# Altium project BA-77GHz-Radar_Frontend.PrjPcb (part 1 of 2)
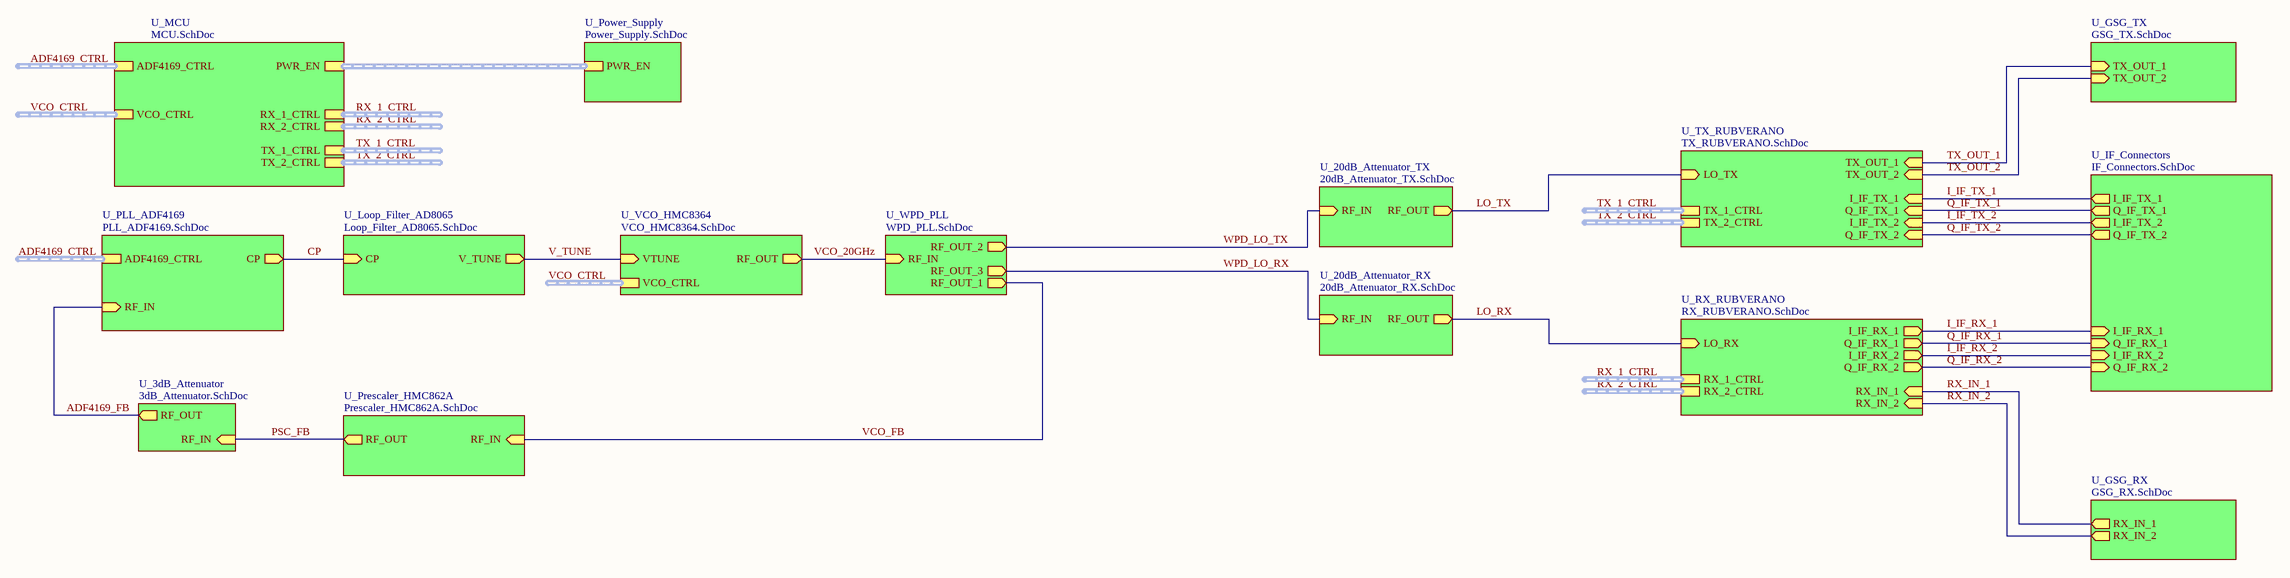
[diagram p0: Top_Level.SchDoc]
25 sheets, 275 parts. Net scope: hierarchical (ports join the sheet entries above them; power ports are global).
Board file: BA-77GHz-Radar_Frontend.PcbDoc
Sheets:
  Top_Level.SchDoc
    U_Power_Supply = Power_Supply.SchDoc
      Boost_Converter_16V = TPS61377_16V.SchDoc
      LDO_OPV_15V = LT3042_15V.SchDoc
      LDO_VCO_5V = LT3042_5V.SchDoc
      LDO_Prescaler_5V = LT3042_5V.SchDoc
      LDO_Analog_ADF4169_3V3 = LT3042_3V3.SchDoc
      LDO_TX_3V3 = LT3045_3V3.SchDoc
      LDO_Digital_ADF4169_1V8 = XC6204_1V8.SchDoc
      Buck_Converter_4V = AP62500_4V.SchDoc
      Buck_Converter_6V = AP62500_6V.SchDoc
      LDO_STM32_3V3 = TLV755P_3V3.SchDoc
      LDO_RX_3V3 = LT3045_3V3.SchDoc
    U_MCU = MCU.SchDoc
    U_PLL_ADF4169 = PLL_ADF4169.SchDoc
    U_Prescaler_HMC862A = Prescaler_HMC862A.SchDoc
    U_Loop_Filter_AD8065 = Loop_Filter_AD8065.SchDoc
    U_VCO_HMC8364 = VCO_HMC8364.SchDoc
    U_TX_RUBVERANO = TX_RUBVERANO.SchDoc
    U_RX_RUBVERANO = RX_RUBVERANO.SchDoc
    U_3dB_Attenuator = 3dB_Attenuator.SchDoc
    U_WPD_PLL = WPD_PLL.SchDoc
    U_20dB_Attenuator_RX = 20dB_Attenuator_RX.SchDoc
    U_20dB_Attenuator_TX = 20dB_Attenuator_TX.SchDoc
    U_GSG_RX = GSG_RX.SchDoc
    U_GSG_TX = GSG_TX.SchDoc
    U_IF_Connectors = IF_Connectors.SchDoc

## Sheet Top_Level.SchDoc
size A2; SheetNumber: 1; SheetTotal: 25

### Sub-sheets
U_3dB_Attenuator = 3dB_Attenuator.SchDoc: RF_IN (in), RF_OUT (out)
U_20dB_Attenuator_RX = 20dB_Attenuator_RX.SchDoc: RF_IN (in), RF_OUT (out)
U_20dB_Attenuator_TX = 20dB_Attenuator_TX.SchDoc: RF_IN (in), RF_OUT (out)
U_GSG_RX = GSG_RX.SchDoc: RX_IN_1 (out), RX_IN_2 (out)
U_GSG_TX = GSG_TX.SchDoc: TX_OUT_1 (in), TX_OUT_2 (in)
U_IF_Connectors = IF_Connectors.SchDoc: Q_IF_TX_2 (out), I_IF_TX_2 (out), Q_IF_RX_2 (in), I_IF_RX_2 (in), I_IF_RX_1 (in), Q_IF_RX_1 (in), I_IF_TX_1 (out), Q_IF_TX_1 (out)
U_Loop_Filter_AD8065 = Loop_Filter_AD8065.SchDoc: V_TUNE (out), CP (in)
U_MCU = MCU.SchDoc: PWR_EN (harness PWR_EN), ADF4169_CTRL (harness ADF4169_CTRL), VCO_CTRL (harness VCO_CTRL), RX_1_CTRL (harness RX_1_CTRL), RX_2_CTRL (harness RX_2_CTRL), TX_1_CTRL (harness TX_1_CTRL), TX_2_CTRL (harness TX_2_CTRL)
U_PLL_ADF4169 = PLL_ADF4169.SchDoc: ADF4169_CTRL (harness ADF4169_CTRL), CP (out), RF_IN (in)
U_Power_Supply = Power_Supply.SchDoc: PWR_EN (harness PWR_EN)
U_Prescaler_HMC862A = Prescaler_HMC862A.SchDoc: RF_IN (in), RF_OUT (out)
U_RX_RUBVERANO = RX_RUBVERANO.SchDoc: I_IF_RX_1 (out), I_IF_RX_2 (out), Q_IF_RX_1 (out), Q_IF_RX_2 (out), RX_IN_1 (in), RX_IN_2 (in), RX_2_CTRL (harness RX_2_CTRL), RX_1_CTRL (harness RX_1_CTRL), LO_RX (in)
U_TX_RUBVERANO = TX_RUBVERANO.SchDoc: I_IF_TX_1 (in), I_IF_TX_2 (in), Q_IF_TX_2 (in), Q_IF_TX_1 (in), TX_OUT_1 (in), TX_OUT_2 (in), TX_2_CTRL (harness TX_2_CTRL), TX_1_CTRL (harness TX_1_CTRL), LO_TX (in)
U_VCO_HMC8364 = VCO_HMC8364.SchDoc: VTUNE (in), VCO_CTRL (harness VCO_CTRL), RF_OUT (out)
U_WPD_PLL = WPD_PLL.SchDoc: RF_IN (in), RF_OUT_1 (out), RF_OUT_2 (out), RF_OUT_3 (out)

### Nets
ADF4169_FB: sheet U_PLL_ADF4169/RF_IN, sheet U_3dB_Attenuator/RF_OUT
CP: sheet U_PLL_ADF4169/CP, sheet U_Loop_Filter_AD8065/CP
I_IF_RX_1: sheet U_RX_RUBVERANO/I_IF_RX_1, sheet U_IF_Connectors/I_IF_RX_1
I_IF_RX_2: sheet U_RX_RUBVERANO/I_IF_RX_2, sheet U_IF_Connectors/I_IF_RX_2
I_IF_TX_1: sheet U_TX_RUBVERANO/I_IF_TX_1, sheet U_IF_Connectors/I_IF_TX_1
I_IF_TX_2: sheet U_TX_RUBVERANO/I_IF_TX_2, sheet U_IF_Connectors/I_IF_TX_2
LO_RX: sheet U_RX_RUBVERANO/LO_RX, sheet U_20dB_Attenuator_RX/RF_OUT
LO_TX: sheet U_TX_RUBVERANO/LO_TX, sheet U_20dB_Attenuator_TX/RF_OUT
PSC_FB: sheet U_Prescaler_HMC862A/RF_OUT, sheet U_3dB_Attenuator/RF_IN
Q_IF_RX_1: sheet U_RX_RUBVERANO/Q_IF_RX_1, sheet U_IF_Connectors/Q_IF_RX_1
Q_IF_RX_2: sheet U_RX_RUBVERANO/Q_IF_RX_2, sheet U_IF_Connectors/Q_IF_RX_2
Q_IF_TX_1: sheet U_TX_RUBVERANO/Q_IF_TX_1, sheet U_IF_Connectors/Q_IF_TX_1
Q_IF_TX_2: sheet U_TX_RUBVERANO/Q_IF_TX_2, sheet U_IF_Connectors/Q_IF_TX_2
RX_IN_1: sheet U_RX_RUBVERANO/RX_IN_1, sheet U_GSG_RX/RX_IN_1
RX_IN_2: sheet U_RX_RUBVERANO/RX_IN_2, sheet U_GSG_RX/RX_IN_2
TX_OUT_1: sheet U_TX_RUBVERANO/TX_OUT_1, sheet U_GSG_TX/TX_OUT_1
TX_OUT_2: sheet U_TX_RUBVERANO/TX_OUT_2, sheet U_GSG_TX/TX_OUT_2
V_TUNE: sheet U_Loop_Filter_AD8065/V_TUNE, sheet U_VCO_HMC8364/VTUNE
VCO_20GHz: sheet U_VCO_HMC8364/RF_OUT, sheet U_WPD_PLL/RF_IN
VCO_FB: sheet U_Prescaler_HMC862A/RF_IN, sheet U_WPD_PLL/RF_OUT_1
WPD_LO_RX: sheet U_WPD_PLL/RF_OUT_3, sheet U_20dB_Attenuator_RX/RF_IN
WPD_LO_TX: sheet U_WPD_PLL/RF_OUT_2, sheet U_20dB_Attenuator_TX/RF_IN

### Buses and harness runs
harness ADF4169_CTRL = sheet U_MCU/ADF4169_CTRL
harness ADF4169_CTRL = sheet U_PLL_ADF4169/ADF4169_CTRL
harness RX_1_CTRL = sheet U_MCU/RX_1_CTRL
harness RX_1_CTRL = sheet U_RX_RUBVERANO/RX_1_CTRL
harness RX_2_CTRL = sheet U_MCU/RX_2_CTRL
harness RX_2_CTRL = sheet U_RX_RUBVERANO/RX_2_CTRL
harness sheet U_MCU/PWR_EN = sheet U_Power_Supply/PWR_EN
harness TX_1_CTRL = sheet U_MCU/TX_1_CTRL
harness TX_1_CTRL = sheet U_TX_RUBVERANO/TX_1_CTRL
harness TX_2_CTRL = sheet U_MCU/TX_2_CTRL
harness TX_2_CTRL = sheet U_TX_RUBVERANO/TX_2_CTRL
harness VCO_CTRL = sheet U_MCU/VCO_CTRL
harness VCO_CTRL = sheet U_VCO_HMC8364/VCO_CTRL

## Sheet Power_Supply.SchDoc
size A3; SheetNumber: 2; SheetTotal: 25
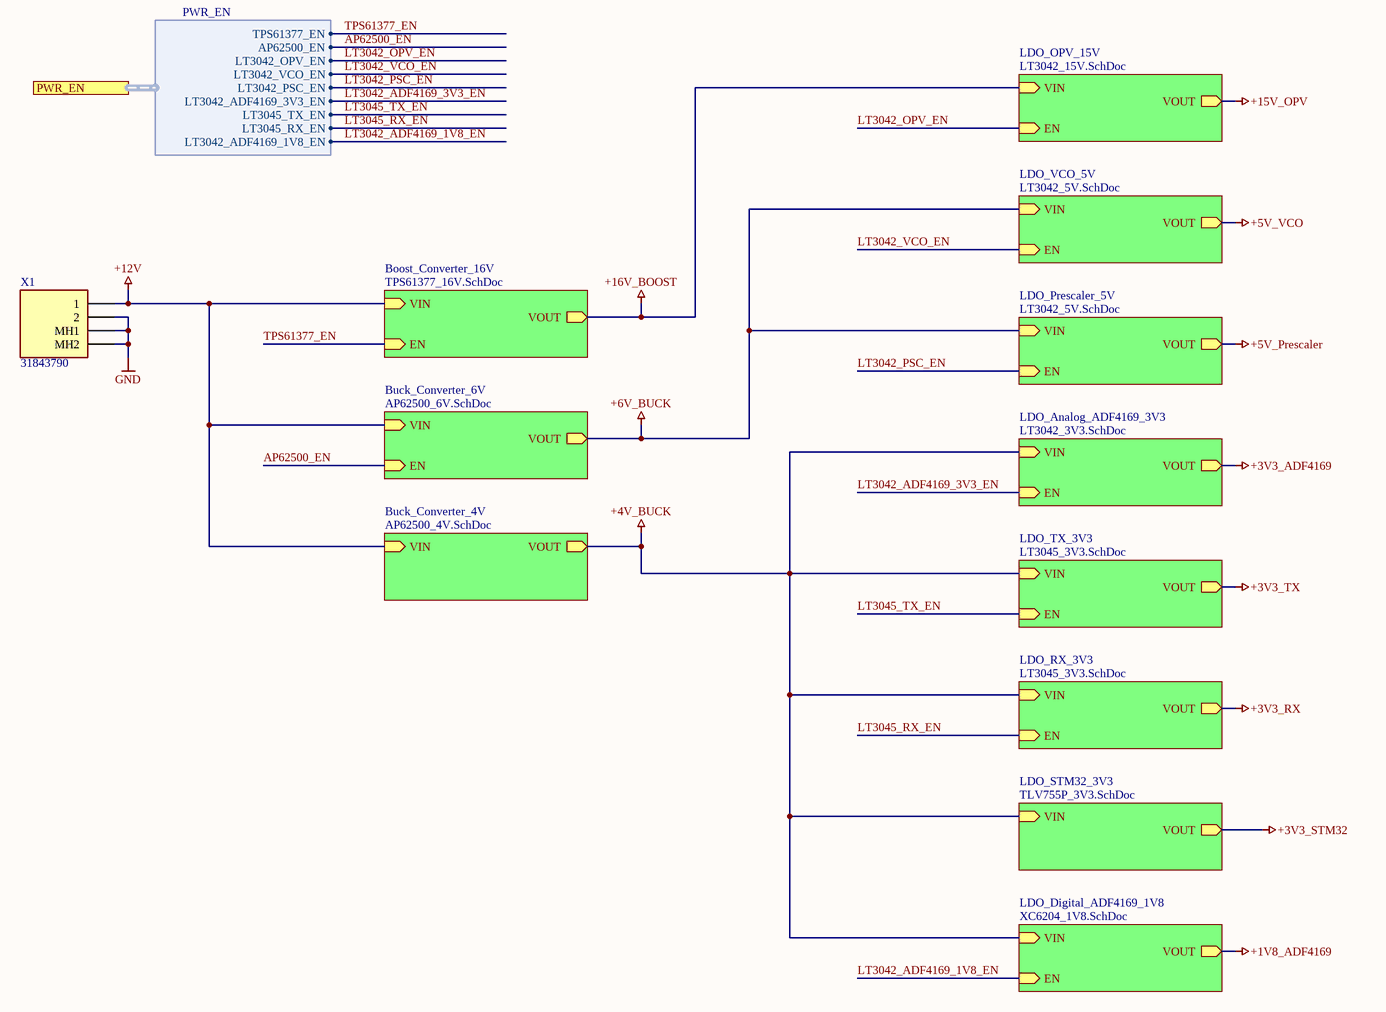
[diagram p1: Power_Supply.SchDoc]

### Parts
X1  31843790  [31843790]

### Sub-sheets
Boost_Converter_16V = TPS61377_16V.SchDoc: VIN (in), VOUT (out), EN (in)
Buck_Converter_4V = AP62500_4V.SchDoc: VIN (in), VOUT (out)
Buck_Converter_6V = AP62500_6V.SchDoc: VIN (in), VOUT (out), EN (in)
LDO_Analog_ADF4169_3V3 = LT3042_3V3.SchDoc: VIN (in), EN (in), VOUT (out)
LDO_Digital_ADF4169_1V8 = XC6204_1V8.SchDoc: VOUT (out), EN (in), VIN (in)
LDO_OPV_15V = LT3042_15V.SchDoc: VOUT (out), VIN (in), EN (in)
LDO_Prescaler_5V = LT3042_5V.SchDoc: VIN (in), EN (in), VOUT (out)
LDO_RX_3V3 = LT3045_3V3.SchDoc: VIN (in), EN (in), VOUT (out)
LDO_STM32_3V3 = TLV755P_3V3.SchDoc: VOUT (out), VIN (in)
LDO_TX_3V3 = LT3045_3V3.SchDoc: VOUT (out), EN (in), VIN (in)
LDO_VCO_5V = LT3042_5V.SchDoc: VIN (in), EN (in), VOUT (out)

### Ports
PWR_EN (harness PWR_EN, see Top_Level[3B], MCU[5B])

### Harnesses
PWR_EN: AP62500_EN, LT3042_OPV_EN, LT3042_VCO_EN, LT3042_PSC_EN, LT3042_ADF4169_3V3_EN, LT3045_TX_EN, TPS61377_EN, LT3042_ADF4169_1V8_EN, LT3045_RX_EN

### Nets
+4V_BUCK: sheet LDO_Analog_ADF4169_3V3/VIN, sheet LDO_TX_3V3/VIN, sheet LDO_Digital_ADF4169_1V8/VIN, sheet Buck_Converter_4V/VOUT, sheet LDO_STM32_3V3/VIN, sheet LDO_RX_3V3/VIN
+6V_BUCK: sheet LDO_VCO_5V/VIN, sheet LDO_Prescaler_5V/VIN, sheet Buck_Converter_6V/VOUT
+12V: X1.1 ; sheet Boost_Converter_16V/VIN, sheet Buck_Converter_4V/VIN, sheet Buck_Converter_6V/VIN
+16V_BOOST: sheet Boost_Converter_16V/VOUT, sheet LDO_OPV_15V/VIN
GND: X1.2 X1.MH1 X1.MH2
AP62500_EN: sheet Buck_Converter_6V/EN, port PWR_EN.AP62500_EN
LT3042_ADF4169_1V8_EN: sheet LDO_Digital_ADF4169_1V8/EN, port PWR_EN.LT3042_ADF4169_1V8_EN
LT3042_ADF4169_3V3_EN: sheet LDO_Analog_ADF4169_3V3/EN, port PWR_EN.LT3042_ADF4169_3V3_EN
LT3042_OPV_EN: sheet LDO_OPV_15V/EN, port PWR_EN.LT3042_OPV_EN
LT3042_PSC_EN: sheet LDO_Prescaler_5V/EN, port PWR_EN.LT3042_PSC_EN
LT3042_VCO_EN: sheet LDO_VCO_5V/EN, port PWR_EN.LT3042_VCO_EN
LT3045_RX_EN: sheet LDO_RX_3V3/EN, port PWR_EN.LT3045_RX_EN
LT3045_TX_EN: sheet LDO_TX_3V3/EN, port PWR_EN.LT3045_TX_EN
TPS61377_EN: sheet Boost_Converter_16V/EN, port PWR_EN.TPS61377_EN

### Library data of the parts
X1 = X000004: Manufacturer: Phoenix Contact; ID: X000004; Type: Phoenix Board Connector; Manufacturer Part Number: 31843790; Part Value: 31843790; Case: 31843790; ComponentLink1Description: Datasheet; ComponentLink1URL: https://www.phoenixcontact.com/en-us/products/pcb-header-mc-15-2-gf-35-1843790?type=pdf; Supplier 1: Mouser; Supplier Part Number 1: 651-1843790; Supplier 2: Digikey; Supplier Part Number 2: 277-5882-ND

## Sheet TPS61377_16V.SchDoc
size A4; SheetNumber: 3; SheetTotal: 27
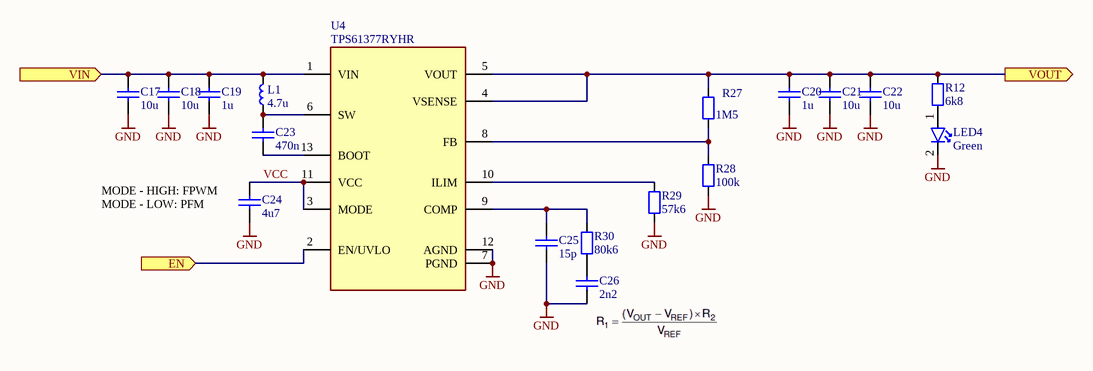
[diagram p2: TPS61377_16V.SchDoc]

### Parts
C17  10u  [C_1206_3216Metric_IPC_N]
C18  10u  [C_1206_3216Metric_IPC_N]
C19  1u  [C_0402_1005Metric_IPC_N]
C20  1u  [C_0402_1005Metric_IPC_N]
C21  10u  [C_1206_3216Metric_IPC_N]
C22  10u  [C_1206_3216Metric_IPC_N]
C23  470n  [C_0402_1005Metric_IPC_N]
C24  4u7  [C_0402_1005Metric_IPC_N]
C25  15p  [C_0402_1005Metric_IPC_N]
C26  2n2  [C_0402_1005Metric_IPC_N]
L1  4.7u  [L_1616_4040Metric_IPC_N]
LED4  Green  [LED_0603_1806Metric_IPC_N]
R12  6k8  [R_0402_1005Metric_IPC_N]
R27  1M5  [R_0402_1005Metric_IPC_N]
R28  100k  [R_0402_1005Metric_IPC_N]
R29  57k6  [R_0402_1005Metric_IPC_N]
R30  80k6  [R_0402_1005Metric_IPC_N]
U4  TPS61377RYHR  [VQFN13_2_5x2]

### Ports
EN (in, see Power_Supply[3B]), VIN (in, see Power_Supply[3B], AP62500_4V[1B], AP62500_6V[1B]), VOUT (out, see Power_Supply[3B])

### Nets
+12V: C17.2 C18.2 C19.2 L1.2 U4.1(VIN) ; port VIN
+16V_BOOST: C20.2 C21.2 C22.2 R12.1 R27.2 U4.4(VSENSE) U4.5(VOUT) ; port VOUT
GND: C17.1 C18.1 C19.1 C20.1 C21.1 C22.1 C24.1 C25.1 C26.1 LED4.2 R28.1 R29.1 U4.7(PGND) U4.12(AGND)
TPS61377_EN: U4.2(EN/UVLO) ; port EN
VCC: C24.2 U4.3(MODE) U4.11(VCC)
NetC23_1: C23.1 U4.13(BOOT)
NetC23_2: C23.2 L1.1 U4.6(SW)
NetC25_2: C25.2 R30.2 U4.9(COMP)
NetC26_2: C26.2 R30.1
NetLED4_1: LED4.1 R12.2
NetR27_1: R27.1 R28.2 U4.8(FB)
NetR29_2: R29.2 U4.10(ILIM)

### Notes on the sheet
- (near C24) MODE - HIGH: FPWM
  MODE - LOW: PFM

### Library data of the parts
C17 C18 C21 C22 = C000005: Generic MLCC with 1206 Footprint; Specific Component: False; Temp Coefficient: X7R; Voltage Rated: 50V; ID: C000005; Capacitance: 10u; Tolerance: *; min Temperature: *; max Temperature: *; Case: 1206
C19 C20 C25 C26 = C000002: Generic MLCC with 0402 Footprint; Specific Component: False; Temp Coefficient: X7R; Voltage Rated: 50V; ID: C000002; Tolerance: *; min Temperature: *; max Temperature: *; Case: 0402
  C19 C20: Capacitance: 1u
  C25: Capacitance: 15p
  C26: Capacitance: 2n2
C23 C24 = C000002: Generic MLCC with 0402 Footprint; Specific Component: False; ID: C000002; Tolerance: *; Temp Coefficient: *; Voltage Rated: *; min Temperature: *; max Temperature: *; Case: 0402
  C23: Capacitance: 470n
  C24: Capacitance: 4u7
L1 = L000015: Power Inductor, 4.7u, 5A, , 57m, 20%, 1616; Manufacturer: Coilcraft; Manufacturer Part Number: XFL4020-472MEC; Specific Component: True; Current - Saturation: 2.7A; min Temperature: -40; max Temperature: +125; ID: L000015; Type: Power Inductor; Inductance: 4.7u; Tolerance: 20%; Current Rating: 5A; DC resistance: 57m; Case: 1616; ComponentLink1Description: Datasheet; ComponentLink1URL: https://www.coilcraft.com/getmedia/50632d43-da1b-4cdb-8ab4-3029cab51df3/xfl4020.pdf; Supplier 1: Digikey; Supplier Part Number 1: 4652-XFL4020-472MEC-ND; Supplier 2: Mouser; Supplier Part Number 2: 994-XFL4020-472MEC
LED4 = LED000007: MLCC, Low Current, Green, 2.2V, 20mA, 0603; Manufacturer: Broadcom / Avago; Manufacturer Part Number: HSMG-C190; Specific Component: True; ID: LED000007; Type: Low Current; Colour: Green; Forward Voltage: 2.2V; Current: 20mA; Case: 0603; ComponentLink1Description: Datasheet; ComponentLink1URL: https://www.mouser.de/datasheet/3/57/1/AV02_0551EN_DS_HSMx_Cxxx_25Mar2022.pdf; Supplier 1: Mouser; Supplier Part Number 1: 630-HSMG-C190; Supplier 2: Digikey; Supplier Part Number 2: 516-1425-1-ND
R12 = R000002: Generic Chip Resistor with 0402 Footprint; Specific Component: False; ID: R000002; Resistance: 6k8; Tolerance: *; Power Rating: *; Composition: *; min Temperature: *; max Temperature: *; Temp Coefficient: *; Case: 0402
R27-R30 = R000002: Generic Chip Resistor with 0402 Footprint; Specific Component: False; Power Rating: 0.063W; ID: R000002; Tolerance: *; Composition: *; min Temperature: *; max Temperature: *; Temp Coefficient: *; Case: 0402
  R27: Resistance: 1M5
  R28: Resistance: 100k
  R29: Resistance: 57k6
  R30: Resistance: 80k6
U4 = PMIC000032: Manufacturer: Texas Instruments; ID: PMIC000032; Type: DC/DC; Manufacturer Part Number: TPS61377RYHR; Part Value: TPS61377RYHR; Case: VQFN-13 (2.5x2); ComponentLink1Description: Datasheet; ComponentLink1URL: https://www.ti.com/lit/ds/symlink/tps61377.pdf?ts=1770979054548&ref_url=https%253A%252F%252Fwww.ti.com%252Fproduct%252Fde-de%252FTPS61377; Supplier 1: Digikey; Supplier Part Number 1: 296-TPS61377RYHRCT-ND; Supplier 2: Mouser; Supplier Part Number 2: 595-TPS61377RYHR

## Sheet LT3042_15V.SchDoc
size A4; SheetNumber: 6; SheetTotal: 27
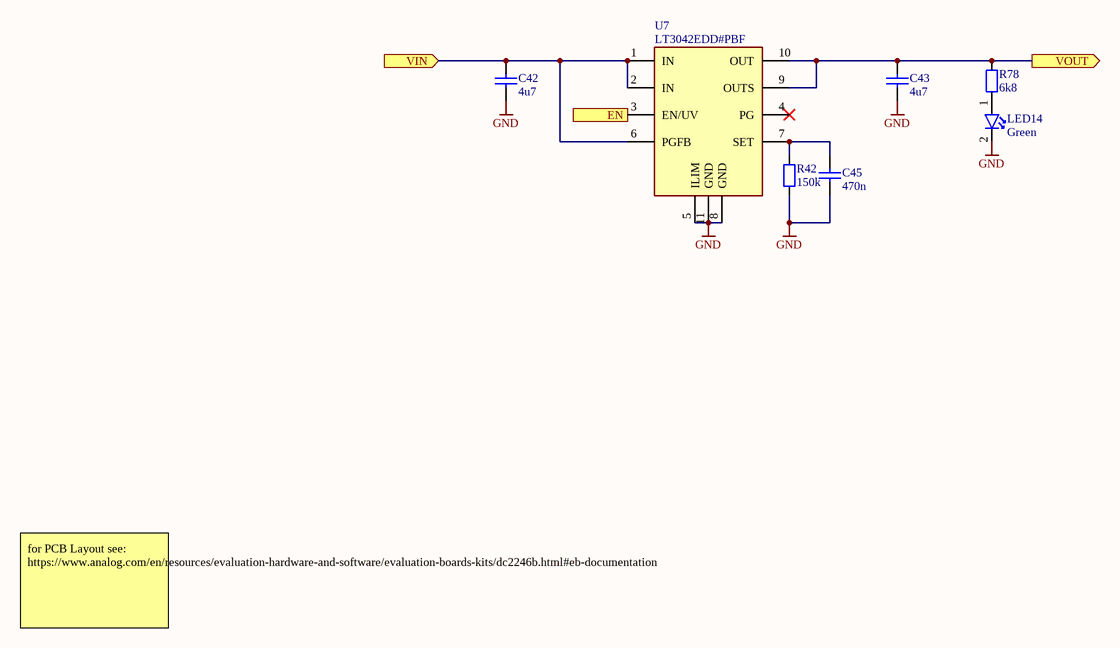
[diagram p3: LT3042_15V.SchDoc]

### Parts
C42  4u7  [C_1206_3216Metric_IPC_N]
C43  4u7  [C_1206_3216Metric_IPC_N]
C45  470n  [C_0402_1005Metric_IPC_N]
LED14  Green  [LED_0603_1806Metric_IPC_N]
R42  150k  [R_0402_1005Metric_IPC_N]
R78  6k8  [R_0402_1005Metric_IPC_N]
U7  LT3042EDD#PBF  [DFN10_3x3]

### Ports
EN (in, see Power_Supply[5A]), VIN (in, see Power_Supply[5A]), VOUT (out, see Power_Supply[6A])

### Nets
+15V_OPV: C43.2 R78.1 U7.9(OUTS) U7.10(OUT) ; port VOUT
+16V_BOOST: C42.2 U7.1(IN) U7.2(IN) U7.6(PGFB) ; port VIN
GND: C42.1 C43.1 C45.1 LED14.2 R42.1 U7.5(ILIM) U7.8(GND) U7.11(GND)
LT3042_OPV_EN: U7.3(EN/UV) ; port EN
NetC45_2: C45.2 R42.2 U7.7(SET)
NetLED14_1: LED14.1 R78.2

Not connected (* = marked no-connect by the designer): U7 4(PG)*

### Notes on the sheet
- for PCB Layout see:
  https://www.analog.com/en/resources/evaluation-hardware-and-software/evaluation-boards-kits/dc2246b.html#eb-documentation

### Library data of the parts
C42 C43 = C000005: Generic MLCC with 1206 Footprint; Specific Component: False; Temp Coefficient: X7R; Voltage Rated: 15V; ID: C000005; Capacitance: 4u7; Tolerance: *; min Temperature: *; max Temperature: *; Case: 1206
C45 = C000002: Generic MLCC with 0402 Footprint; Specific Component: False; Temp Coefficient: X7R; ID: C000002; Capacitance: 470n; Tolerance: *; Voltage Rated: *; min Temperature: *; max Temperature: *; Case: 0402
LED14 = LED000007: as LED4 on sheet TPS61377_16V; ID: LED000007; Type: Low Current; Colour: Green; Forward Voltage: 2.2V; Current: 20mA; Case: 0603; ComponentLink1Description: Datasheet; ComponentLink1URL: https://www.mouser.de/datasheet/3/57/1/AV02_0551EN_DS_HSMx_Cxxx_25Mar2022.pdf; Supplier 1: Mouser; Supplier Part Number 1: 630-HSMG-C190; Supplier 2: Digikey; Supplier Part Number 2: 516-1425-1-ND
R42 R78 = R000002: as R12 on sheet TPS61377_16V; ID: R000002; Tolerance: *; Power Rating: *; Composition: *; min Temperature: *; max Temperature: *; Temp Coefficient: *; Case: 0402
  R42: Resistance: 150k
  R78: Resistance: 6k8
U7 = PMIC000029: Manufacturer: Analog Devices; ID: PMIC000029; Type: LDO; Manufacturer Part Number: LT3042EDD#PBF; Part Value: LT3042EDD#PBF; Case: 10-DFN (3x3); ComponentLink1Description: Datasheet; ComponentLink1URL: https://www.analog.com/media/en/technical-documentation/data-sheets/lt3042.pdf; Supplier 1: Digikey; Supplier Part Number 1: 505-LT3042EDD#PBF-ND; Supplier 2: Mouser; Supplier Part Number 2: 584-LT3042EDD#PBF

## Sheet LT3042_5V.SchDoc
size A4; SheetNumber: 7; SheetTotal: 27
Used 2 times, as channels U_Power_Supply/LDO_VCO_5V, U_Power_Supply/LDO_Prescaler_5V. Parts and nets are listed once, with the designators drawn on the sheet.
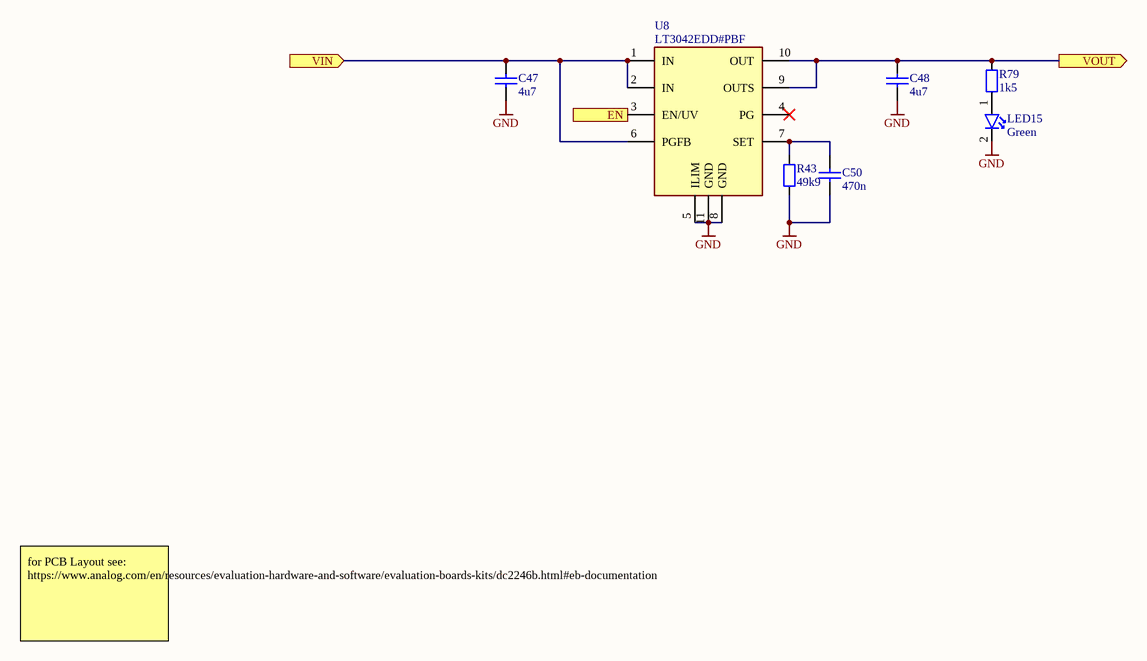
[diagram p4: LT3042_5V.SchDoc]

### Parts
C47  4u7  [C_1206_3216Metric_IPC_N]
C48  4u7  [C_1206_3216Metric_IPC_N]
C50  470n  [C_0402_1005Metric_IPC_N]
LED15  Green  [LED_0603_1806Metric_IPC_N]
R43  49k9  [R_0402_1005Metric_IPC_N]
R79  1k5  [R_0402_1005Metric_IPC_N]
U8  LT3042EDD#PBF  [DFN10_3x3]

### Ports
EN (in, see Power_Supply[5B]), VIN (in, see Power_Supply[5B]), VOUT (out, see Power_Supply[6B])

### Nets
GND: C47.1 C48.1 C50.1 LED15.2 R43.1 U8.5(ILIM) U8.8(GND) U8.11(GND)
EN: U8.3(EN/UV) ; port EN
VIN: C47.2 U8.1(IN) U8.2(IN) U8.6(PGFB) ; port VIN
VOUT: C48.2 R79.1 U8.9(OUTS) U8.10(OUT) ; port VOUT
NetC50_2: C50.2 R43.2 U8.7(SET)
NetLED15_1: LED15.1 R79.2

Not connected (* = marked no-connect by the designer): U8 4(PG)*

### Channels
U_Power_Supply/LDO_VCO_5V: designators end in _LDO_VCO_5V; ports EN=LT3042_VCO_EN VIN=+6V_BUCK VOUT=+5V_VCO
U_Power_Supply/LDO_Prescaler_5V: designators end in _LDO_Prescaler_5V; ports EN=LT3042_PSC_EN VIN=+6V_BUCK VOUT=+5V_Prescaler

### Notes on the sheet
- for PCB Layout see:
  https://www.analog.com/en/resources/evaluation-hardware-and-software/evaluation-boards-kits/dc2246b.html#eb-documentation

### Library data of the parts
C47 C48 = C000005: as C42 on sheet LT3042_15V; ID: C000005; Capacitance: 4u7; Tolerance: *; min Temperature: *; max Temperature: *; Case: 1206
C50 = C000002: as C45 on sheet LT3042_15V; ID: C000002; Capacitance: 470n; Tolerance: *; Voltage Rated: *; min Temperature: *; max Temperature: *; Case: 0402
LED15 = LED000007: as LED4 on sheet TPS61377_16V; ID: LED000007; Type: Low Current; Colour: Green; Forward Voltage: 2.2V; Current: 20mA; Case: 0603; ComponentLink1Description: Datasheet; ComponentLink1URL: https://www.mouser.de/datasheet/3/57/1/AV02_0551EN_DS_HSMx_Cxxx_25Mar2022.pdf; Supplier 1: Mouser; Supplier Part Number 1: 630-HSMG-C190; Supplier 2: Digikey; Supplier Part Number 2: 516-1425-1-ND
R43 R79 = R000002: as R12 on sheet TPS61377_16V; ID: R000002; Tolerance: *; Power Rating: *; Composition: *; min Temperature: *; max Temperature: *; Temp Coefficient: *; Case: 0402
  R43: Resistance: 49k9
  R79: Resistance: 1k5
U8 = PMIC000029: Manufacturer: Analog Devices; ID: PMIC000029; Type: LDO; Manufacturer Part Number: LT3042EDD#PBF; Part Value: LT3042EDD#PBF; Case: 10-DFN (3x3); ComponentLink1Description: Datasheet; ComponentLink1URL: https://www.analog.com/media/en/technical-documentation/data-sheets/lt3042.pdf; Supplier 1: Digikey; Supplier Part Number 1: 505-LT3042EDD#PBF-ND; Supplier 2: Mouser; Supplier Part Number 2: 584-LT3042EDD#PBF

## Sheet LT3042_3V3.SchDoc
size A4; SheetNumber: 8; SheetTotal: 27
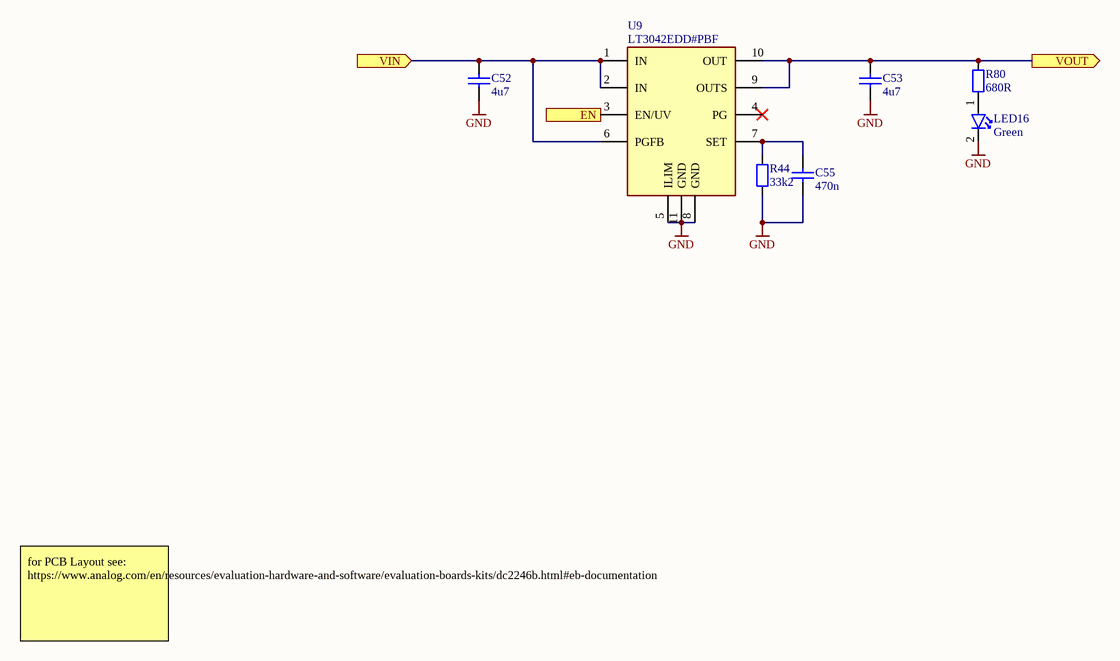
[diagram p5: LT3042_3V3.SchDoc]

### Parts
C52  4u7  [C_1206_3216Metric_IPC_N]
C53  4u7  [C_1206_3216Metric_IPC_N]
C55  470n  [C_0402_1005Metric_IPC_N]
LED16  Green  [LED_0603_1806Metric_IPC_N]
R44  33k2  [R_0402_1005Metric_IPC_N]
R80  680R  [R_0402_1005Metric_IPC_N]
U9  LT3042EDD#PBF  [DFN10_3x3]

### Ports
EN (in, see Power_Supply[5B]), VIN (in, see Power_Supply[5B], LT3045_3V3[2B], TLV755P_3V3[2B], XC6204_1V8[2B]), VOUT (out, see Power_Supply[6B])

### Nets
+3V3_ADF4169: C53.2 R80.1 U9.9(OUTS) U9.10(OUT) ; port VOUT
+4V_BUCK: C52.2 U9.1(IN) U9.2(IN) U9.6(PGFB) ; port VIN
GND: C52.1 C53.1 C55.1 LED16.2 R44.1 U9.5(ILIM) U9.8(GND) U9.11(GND)
LT3042_ADF4169_3V3_EN: U9.3(EN/UV) ; port EN
NetC55_2: C55.2 R44.2 U9.7(SET)
NetLED16_1: LED16.1 R80.2

Not connected (* = marked no-connect by the designer): U9 4(PG)*

### Notes on the sheet
- for PCB Layout see:
  https://www.analog.com/en/resources/evaluation-hardware-and-software/evaluation-boards-kits/dc2246b.html#eb-documentation

### Library data of the parts
C52 C53 = C000005: as C42 on sheet LT3042_15V; ID: C000005; Capacitance: 4u7; Tolerance: *; min Temperature: *; max Temperature: *; Case: 1206
C55 = C000002: as C45 on sheet LT3042_15V; ID: C000002; Capacitance: 470n; Tolerance: *; Voltage Rated: *; min Temperature: *; max Temperature: *; Case: 0402
LED16 = LED000007: as LED4 on sheet TPS61377_16V; ID: LED000007; Type: Low Current; Colour: Green; Forward Voltage: 2.2V; Current: 20mA; Case: 0603; ComponentLink1Description: Datasheet; ComponentLink1URL: https://www.mouser.de/datasheet/3/57/1/AV02_0551EN_DS_HSMx_Cxxx_25Mar2022.pdf; Supplier 1: Mouser; Supplier Part Number 1: 630-HSMG-C190; Supplier 2: Digikey; Supplier Part Number 2: 516-1425-1-ND
R44 R80 = R000002: as R12 on sheet TPS61377_16V; ID: R000002; Tolerance: *; Power Rating: *; Composition: *; min Temperature: *; max Temperature: *; Temp Coefficient: *; Case: 0402
  R44: Resistance: 33k2
  R80: Resistance: 680R
U9 = PMIC000029: Manufacturer: Analog Devices; ID: PMIC000029; Type: LDO; Manufacturer Part Number: LT3042EDD#PBF; Part Value: LT3042EDD#PBF; Case: 10-DFN (3x3); ComponentLink1Description: Datasheet; ComponentLink1URL: https://www.analog.com/media/en/technical-documentation/data-sheets/lt3042.pdf; Supplier 1: Digikey; Supplier Part Number 1: 505-LT3042EDD#PBF-ND; Supplier 2: Mouser; Supplier Part Number 2: 584-LT3042EDD#PBF

## Sheet LT3045_3V3.SchDoc
size A4; SheetNumber: 9; SheetTotal: 27
Used 2 times, as channels U_Power_Supply/LDO_TX_3V3, U_Power_Supply/LDO_RX_3V3. Parts and nets are listed once, with the designators drawn on the sheet.
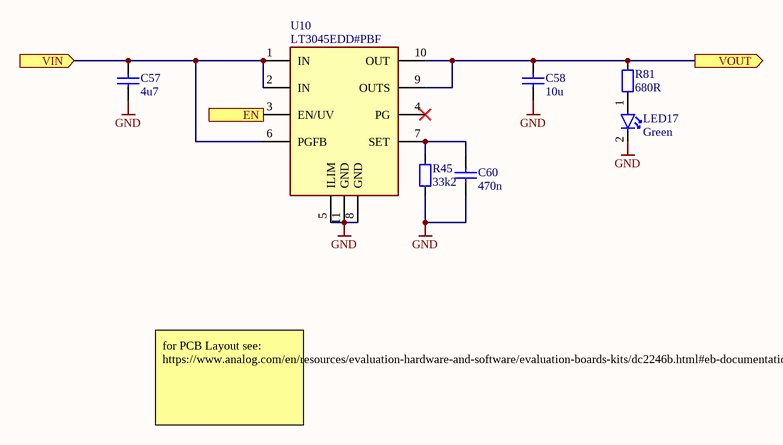
[diagram p6: LT3045_3V3.SchDoc]

### Parts
C57  4u7  [C_1206_3216Metric_IPC_N]
C58  10u  [C_1206_3216Metric_IPC_N]
C60  470n  [C_0402_1005Metric_IPC_N]
LED17  Green  [LED_0603_1806Metric_IPC_N]
R45  33k2  [R_0402_1005Metric_IPC_N]
R81  680R  [R_0402_1005Metric_IPC_N]
U10  LT3045EDD#PBF  [DFN10_3x3]

### Ports
EN (in, see Power_Supply[5C]), VIN (in, see Power_Supply[5C], LT3042_3V3[2B], TLV755P_3V3[2B], XC6204_1V8[2B]), VOUT (out, see Power_Supply[6C])

### Nets
GND: C57.1 C58.1 C60.1 LED17.2 R45.1 U10.5(ILIM) U10.8(GND) U10.11(GND)
EN: U10.3(EN/UV) ; port EN
VIN: C57.2 U10.1(IN) U10.2(IN) U10.6(PGFB) ; port VIN
VOUT: C58.2 R81.1 U10.9(OUTS) U10.10(OUT) ; port VOUT
NetC60_2: C60.2 R45.2 U10.7(SET)
NetLED17_1: LED17.1 R81.2

Not connected (* = marked no-connect by the designer): U10 4(PG)*

### Channels
U_Power_Supply/LDO_TX_3V3: designators end in _LDO_TX_3V3; ports EN=LT3045_TX_EN VIN=+4V_BUCK VOUT=+3V3_TX
U_Power_Supply/LDO_RX_3V3: designators end in _LDO_RX_3V3; ports EN=LT3045_RX_EN VIN=+4V_BUCK VOUT=+3V3_RX

### Notes on the sheet
- for PCB Layout see:
  https://www.analog.com/en/resources/evaluation-hardware-and-software/evaluation-boards-kits/dc2246b.html#eb-documentation

### Library data of the parts
C57 C58 = C000005: as C42 on sheet LT3042_15V; ID: C000005; Tolerance: *; min Temperature: *; max Temperature: *; Case: 1206
  C57: Capacitance: 4u7
  C58: Capacitance: 10u
C60 = C000002: as C45 on sheet LT3042_15V; ID: C000002; Capacitance: 470n; Tolerance: *; Voltage Rated: *; min Temperature: *; max Temperature: *; Case: 0402
LED17 = LED000007: as LED4 on sheet TPS61377_16V; ID: LED000007; Type: Low Current; Colour: Green; Forward Voltage: 2.2V; Current: 20mA; Case: 0603; ComponentLink1Description: Datasheet; ComponentLink1URL: https://www.mouser.de/datasheet/3/57/1/AV02_0551EN_DS_HSMx_Cxxx_25Mar2022.pdf; Supplier 1: Mouser; Supplier Part Number 1: 630-HSMG-C190; Supplier 2: Digikey; Supplier Part Number 2: 516-1425-1-ND
R45 R81 = R000002: as R12 on sheet TPS61377_16V; ID: R000002; Tolerance: *; Power Rating: *; Composition: *; min Temperature: *; max Temperature: *; Temp Coefficient: *; Case: 0402
  R45: Resistance: 33k2
  R81: Resistance: 680R
U10 = PMIC000030: Manufacturer: Analog Devices; ID: PMIC000030; Type: LDO; Manufacturer Part Number: LT3045EDD#PBF; Part Value: LT3045EDD#PBF; Case: 10-DFN (3x3); ComponentLink1Description: Datasheet; ComponentLink1URL: https://www.analog.com/media/en/technical-documentation/data-sheets/lt3045.pdf; Supplier 1: Digikey; Supplier Part Number 1: 505-LT3045EDD#PBF-ND; Supplier 2: Mouser; Supplier Part Number 2: 584-LT3045EDD#PBF

## Sheet XC6204_1V8.SchDoc
size A4; SheetNumber: 11; SheetTotal: 27
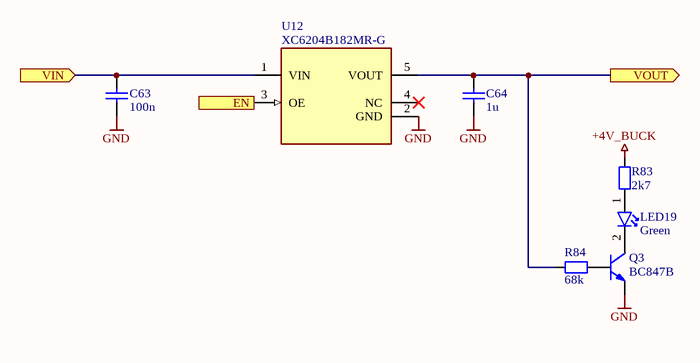
[diagram p7: XC6204_1V8.SchDoc]

### Parts
C63  100n  [C_0603_1608Metric_IPC_N]
C64  1u  [C_0603_1608Metric_IPC_N]
LED19  Green  [LED_0603_1806Metric_IPC_N]
Q3  BC847B  [SOT-23-3]
R83  2k7  [R_0402_1005Metric_IPC_N]
R84  68k  [R_0402_1005Metric_IPC_N]
U12  XC6204B182MR-G  [SOT-23-5]

### Ports
EN (in, see Power_Supply[5D]), VIN (in, see Power_Supply[5C], LT3042_3V3[2B], LT3045_3V3[2B], TLV755P_3V3[2B]), VOUT (out, see Power_Supply[6D])

### Nets
+1V8_ADF4169: C64.2 R84.1 U12.5(VOUT) ; port VOUT
+4V_BUCK: C63.2 R83.2 U12.1(VIN) ; port VIN
GND: C63.1 C64.1 Q3.2(E) U12.2(GND)
LT3042_ADF4169_1V8_EN: U12.3(OE) ; port EN
NetLED19_1: LED19.1 R83.1
NetLED19_2: LED19.2 Q3.3(C)
NetQ3_1: Q3.1(B) R84.2

Not connected (* = marked no-connect by the designer): U12 4(NC)*

### Library data of the parts
C63 C64 = C000003: Generic MLCC with 0603 Footprint; Specific Component: False; Temp Coefficient: X7R; Voltage Rated: 15V; ID: C000003; Tolerance: *; min Temperature: *; max Temperature: *; Case: 0603
  C63: Capacitance: 100n
  C64: Capacitance: 1u
LED19 = LED000007: as LED4 on sheet TPS61377_16V; ID: LED000007; Type: Low Current; Colour: Green; Forward Voltage: 2.2V; Current: 20mA; Case: 0603; ComponentLink1Description: Datasheet; ComponentLink1URL: https://www.mouser.de/datasheet/3/57/1/AV02_0551EN_DS_HSMx_Cxxx_25Mar2022.pdf; Supplier 1: Mouser; Supplier Part Number 1: 630-HSMG-C190; Supplier 2: Digikey; Supplier Part Number 2: 516-1425-1-ND
Q3 = PMIC000033: Manufacturer: Diotec Semiconductor; ID: PMIC000033; Type: NPN; Manufacturer Part Number: BC847B; Part Value: BC847B; Case: SOT-23-3; ComponentLink1Description: Datasheet; ComponentLink1URL: https://diotec.com/request/datasheet/bc846.pdf; Supplier 1: Digikey; Supplier Part Number 1: 4878-BC847BCT-ND; Supplier 2: Mouser; Supplier Part Number 2: 637-BC847B
R83 R84 = R000002: as R12 on sheet TPS61377_16V; ID: R000002; Tolerance: *; Power Rating: *; Composition: *; min Temperature: *; max Temperature: *; Temp Coefficient: *; Case: 0402
  R83: Resistance: 2k7
  R84: Resistance: 68k
U12 = PMIC000005: Manufacturer: Torex Semiconductor; ID: PMIC000005; Type: LDO; Manufacturer Part Number: XC6204B182MR-G; Part Value: XC6204B182MR-G; Case: SOT-25-5; ComponentLink1Description: Datasheet; ComponentLink1URL: https://product.torexsemi.com/system/files/series/xc6204.pdf; Supplier 1: Digikey; Supplier Part Number 1: 893-1060-1-ND; Supplier 2: Mouser; Supplier Part Number 2: 865-XC6204B182MR-G

## Sheet AP62500_4V.SchDoc
size A4; SheetNumber: 5; SheetTotal: 27
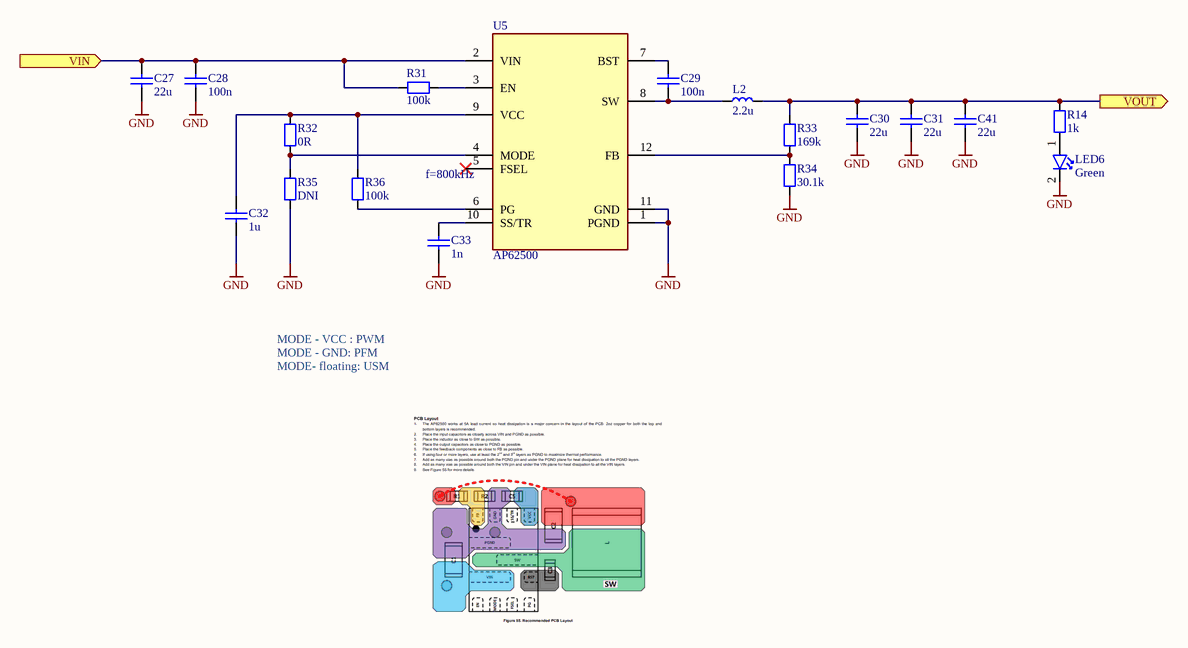
[diagram p8: AP62500_4V.SchDoc]

### Parts
C27  22u  [C_1206_3216Metric_IPC_N]
C28  100n  [C_0603_1608Metric_IPC_N]
C29  100n  [C_0402_1005Metric_IPC_N]
C30  22u  [C_1206_3216Metric_IPC_N]
C31  22u  [C_1206_3216Metric_IPC_N]
C32  1u  [C_0603_1608Metric_IPC_N]
C33  1n  [C_0402_1005Metric_IPC_N]
C41  22u  [C_1206_3216Metric_IPC_N]
L2  2.2u  [AVX_LMLP07A7]
LED6  Green  [LED_0603_1806Metric_IPC_N]
R14  1k  [R_0402_1005Metric_IPC_N]
R31  100k  [R_0402_1005Metric_IPC_N]
R32  0R  [R_0402_1005Metric_IPC_N]
R33  169k  [R_0402_1005Metric_IPC_N]
R34  30.1k  [R_0402_1005Metric_IPC_N]
R35  DNI  [R_0402_1005Metric_IPC_N]
R36  100k  [R_0402_1005Metric_IPC_N]
U5  AP62500  [V-QFN2030-12-Type-A_3.05x2.05mm_P0.5mm]

### Ports
VIN (in, see Power_Supply[3B], AP62500_6V[1B], TPS61377_16V[1B]), VOUT (out, see Power_Supply[3B])

### Nets
+4V_BUCK: C30.2 C31.2 C41.2 L2.2 R14.1 R33.2 ; port VOUT
+12V: C27.2 C28.2 R31.1 U5.2(VIN) ; port VIN
GND: C27.1 C28.1 C30.1 C31.1 C32.1 C33.1 C41.1 LED6.2 R34.1 R35.1 U5.1(PGND) U5.11(GND)
NetC29_1: C29.1 L2.1 U5.8(SW)
NetC29_2: C29.2 U5.7(BST)
NetC32_2: C32.2 R32.2 R36.2 U5.9(VCC)
NetC33_2: C33.2 U5.10(SS/TR)
NetLED6_1: LED6.1 R14.2
NetR31_2: R31.2 U5.3(EN)
NetR32_1: R32.1 R35.2 U5.4(MODE)
NetR33_1: R33.1 R34.2 U5.12(FB)
NetR36_1: R36.1 U5.6(PG)

Not connected (* = marked no-connect by the designer): U5 5(FSEL)*

### Notes on the sheet
- (near U5) f=800kHz
- MODE - VCC : PWM
  MODE - GND: PFM
  MODE- floating: USM

### Library data of the parts
C27 C30 C31 C41 = C000005: Generic MLCC with 1206 Footprint; Specific Component: False; ID: C000005; Capacitance: 22u; Tolerance: *; Temp Coefficient: *; Voltage Rated: *; min Temperature: *; max Temperature: *; Case: 1206
C28 C32 = C000003: Generic MLCC with 0603 Footprint; Specific Component: False; ID: C000003; Tolerance: *; Temp Coefficient: *; Voltage Rated: *; min Temperature: *; max Temperature: *; Case: 0603
  C28: Capacitance: 100n
  C32: Capacitance: 1u; Supplier 1: Mouser; Supplier Part Number 1: 81-GRM185R61E105KA2D
C29 C33 = C000002: as C23 on sheet TPS61377_16V; ID: C000002; Tolerance: *; Temp Coefficient: *; Voltage Rated: *; min Temperature: *; max Temperature: *; Case: 0402
  C29: Capacitance: 100n; Supplier 1: Digikey; Supplier Part Number 1: 1292-1176-1-ND
  C33: Capacitance: 1n; Supplier 1: Mouser; Supplier Part Number 1: 81-GRM1555C2A102GE1D
L2 = L000012: Power Inductor, 2.2u, 8A, -, 20m, 20%, LMLP07A7; Manufacturer: Kyocera/AVX; Manufacturer Part Number: LMLP07A7M2R2DTAS; Current - Saturation: 12A; min Temperature: -55; max Temperature: +155; ID: L000012; Type: Power Inductor; Inductance: 2.2u; Tolerance: 20%; Current Rating: 8A; DC resistance: 20m; Q @ Freq: -; Case: LMLP07A7; ComponentLink1Description: Datasheet; ComponentLink1URL: https://datasheets.kyocera-avx.com/LMLPD.pdf; Supplier 1: Digikey; Supplier Part Number 1: 478-LMLP07A7M2R2DTASCT-ND; Supplier 2: Mouser; Supplier Part Number 2: 581-LMLP07A7M2R2DTAS
LED6 = LED000007: as LED4 on sheet TPS61377_16V; ID: LED000007; Type: Low Current; Colour: Green; Forward Voltage: 2.2V; Current: 20mA; Case: 0603; ComponentLink1Description: Datasheet; ComponentLink1URL: https://www.mouser.de/datasheet/3/57/1/AV02_0551EN_DS_HSMx_Cxxx_25Mar2022.pdf; Supplier 1: Mouser; Supplier Part Number 1: 630-HSMG-C190; Supplier 2: Digikey; Supplier Part Number 2: 516-1425-1-ND
R14 R31-R36 = R000002: as R12 on sheet TPS61377_16V; ID: R000002; Tolerance: *; Power Rating: *; Composition: *; min Temperature: *; max Temperature: *; Temp Coefficient: *; Case: 0402
  R14: Resistance: 1k
  R31 R36: Resistance: 100k
  R32: Resistance: 0R
  R33: Resistance: 169k
  R34: Resistance: 30.1k
  R35: Resistance: DNI
U5 = PMIC000004: Manufacturer: Diodes Incorporated; ID: PMIC000004; Type: DC/DC; Manufacturer Part Number: AP62500; Part Value: AP62500; Case: V-QFN2030-12 (Type A); ComponentLink1Description: Datasheet; ComponentLink1URL: https://www.diodes.com/assets/Datasheets/AP62500.pdf; Supplier 1: Digikey; Supplier Part Number 1: 31-AP62500SJ-7CT-ND; Supplier 2: Mouser; Supplier Part Number 2: 621-AP62500SJ-7

## Sheet AP62500_6V.SchDoc
size A4; SheetNumber: 4; SheetTotal: 27
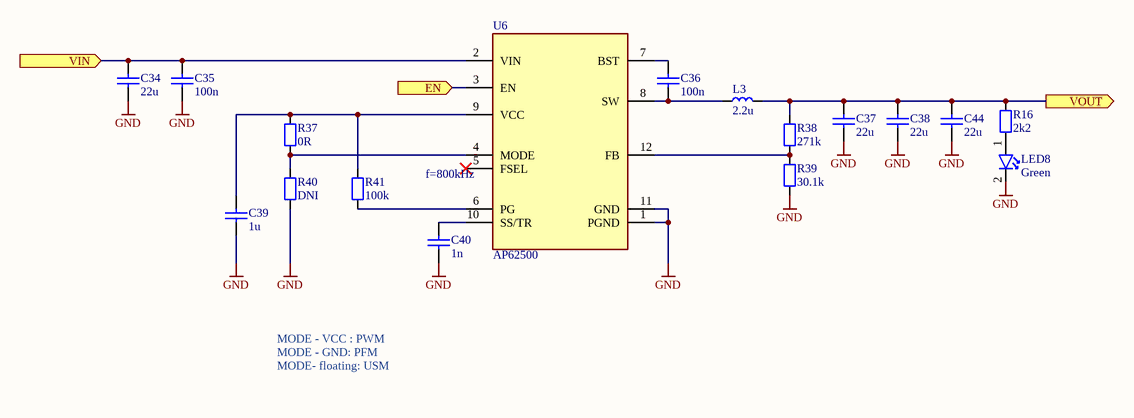
[diagram p9: AP62500_6V.SchDoc]

### Parts
C34  22u  [C_1206_3216Metric_IPC_N]
C35  100n  [C_0603_1608Metric_IPC_N]
C36  100n  [C_0402_1005Metric_IPC_N]
C37  22u  [C_1206_3216Metric_IPC_N]
C38  22u  [C_1206_3216Metric_IPC_N]
C39  1u  [C_0603_1608Metric_IPC_N]
C40  1n  [C_0402_1005Metric_IPC_N]
C44  22u  [C_1206_3216Metric_IPC_N]
L3  2.2u  [AVX_LMLP07A7]
LED8  Green  [LED_0603_1806Metric_IPC_N]
R16  2k2  [R_0402_1005Metric_IPC_N]
R37  0R  [R_0402_1005Metric_IPC_N]
R38  271k  [R_0402_1005Metric_IPC_N]
R39  30.1k  [R_0402_1005Metric_IPC_N]
R40  DNI  [R_0402_1005Metric_IPC_N]
R41  100k  [R_0402_1005Metric_IPC_N]
U6  AP62500  [V-QFN2030-12-Type-A_3.05x2.05mm_P0.5mm]

### Ports
EN (in, see Power_Supply[3B]), VIN (in, see Power_Supply[3B], AP62500_4V[1B], TPS61377_16V[1B]), VOUT (out, see Power_Supply[3B])

### Nets
+6V_BUCK: C37.2 C38.2 C44.2 L3.2 R16.1 R38.2 ; port VOUT
+12V: C34.2 C35.2 U6.2(VIN) ; port VIN
GND: C34.1 C35.1 C37.1 C38.1 C39.1 C40.1 C44.1 LED8.2 R39.1 R40.1 U6.1(PGND) U6.11(GND)
AP62500_EN: U6.3(EN) ; port EN
NetC36_1: C36.1 L3.1 U6.8(SW)
NetC36_2: C36.2 U6.7(BST)
NetC39_2: C39.2 R37.2 R41.2 U6.9(VCC)
NetC40_2: C40.2 U6.10(SS/TR)
NetLED8_1: LED8.1 R16.2
NetR37_1: R37.1 R40.2 U6.4(MODE)
NetR38_1: R38.1 R39.2 U6.12(FB)
NetR41_1: R41.1 U6.6(PG)

Not connected (* = marked no-connect by the designer): U6 5(FSEL)*

### Notes on the sheet
- (near U6) f=800kHz
- MODE - VCC : PWM
  MODE - GND: PFM
  MODE- floating: USM

### Library data of the parts
C34 C37 C38 C44 = C000005: as C27 on sheet AP62500_4V; ID: C000005; Capacitance: 22u; Tolerance: *; Temp Coefficient: *; Voltage Rated: *; min Temperature: *; max Temperature: *; Case: 1206
C35 C39 = C000003: as C28 on sheet AP62500_4V; ID: C000003; Tolerance: *; Temp Coefficient: *; Voltage Rated: *; min Temperature: *; max Temperature: *; Case: 0603
  C35: Capacitance: 100n
  C39: Capacitance: 1u; Supplier 1: Mouser; Supplier Part Number 1: 81-GRM185R61E105KA2D
C36 C40 = C000002: as C23 on sheet TPS61377_16V; ID: C000002; Tolerance: *; Temp Coefficient: *; Voltage Rated: *; min Temperature: *; max Temperature: *; Case: 0402
  C36: Capacitance: 100n; Supplier 1: Digikey; Supplier Part Number 1: 1292-1176-1-ND
  C40: Capacitance: 1n; Supplier 1: Mouser; Supplier Part Number 1: 81-GRM1555C2A102GE1D
L3 = L000012: as L2 on sheet AP62500_4V; ID: L000012; Type: Power Inductor; Inductance: 2.2u; Tolerance: 20%; Current Rating: 8A; DC resistance: 20m; Q @ Freq: -; Case: LMLP07A7; ComponentLink1Description: Datasheet; ComponentLink1URL: https://datasheets.kyocera-avx.com/LMLPD.pdf; Supplier 1: Digikey; Supplier Part Number 1: 478-LMLP07A7M2R2DTASCT-ND; Supplier 2: Mouser; Supplier Part Number 2: 581-LMLP07A7M2R2DTAS
LED8 = LED000007: as LED4 on sheet TPS61377_16V; ID: LED000007; Type: Low Current; Colour: Green; Forward Voltage: 2.2V; Current: 20mA; Case: 0603; ComponentLink1Description: Datasheet; ComponentLink1URL: https://www.mouser.de/datasheet/3/57/1/AV02_0551EN_DS_HSMx_Cxxx_25Mar2022.pdf; Supplier 1: Mouser; Supplier Part Number 1: 630-HSMG-C190; Supplier 2: Digikey; Supplier Part Number 2: 516-1425-1-ND
R16 R37-R41 = R000002: as R12 on sheet TPS61377_16V; ID: R000002; Tolerance: *; Power Rating: *; Composition: *; min Temperature: *; max Temperature: *; Temp Coefficient: *; Case: 0402
  R16: Resistance: 2k2
  R37: Resistance: 0R
  R38: Resistance: 271k
  R39: Resistance: 30.1k
  R40: Resistance: DNI
  R41: Resistance: 100k
U6 = PMIC000004: Manufacturer: Diodes Incorporated; ID: PMIC000004; Type: DC/DC; Manufacturer Part Number: AP62500; Part Value: AP62500; Case: V-QFN2030-12 (Type A); ComponentLink1Description: Datasheet; ComponentLink1URL: https://www.diodes.com/assets/Datasheets/AP62500.pdf; Supplier 1: Digikey; Supplier Part Number 1: 31-AP62500SJ-7CT-ND; Supplier 2: Mouser; Supplier Part Number 2: 621-AP62500SJ-7

## Sheet TLV755P_3V3.SchDoc
size A4; SheetNumber: 10; SheetTotal: 27
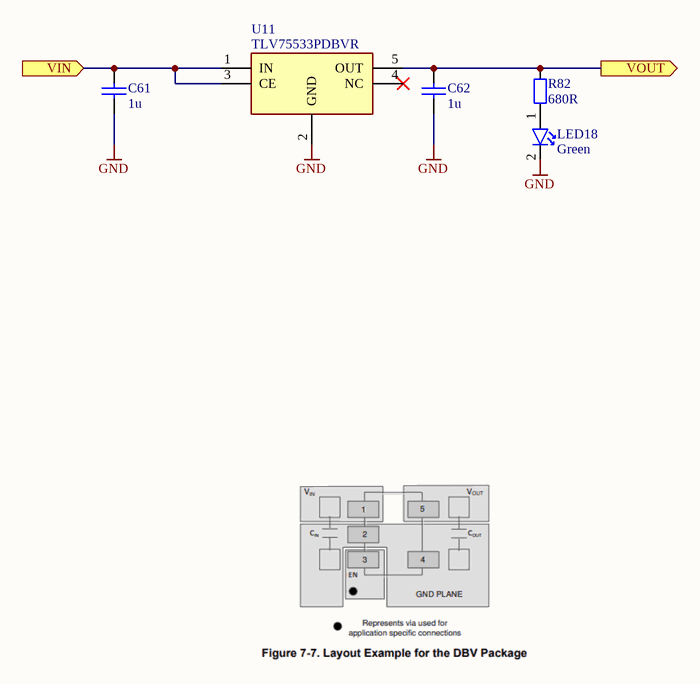
[diagram p10: TLV755P_3V3.SchDoc]

### Parts
C61  1u  [C_0603_1608Metric_IPC_N]
C62  1u  [C_0603_1608Metric_IPC_N]
LED18  Green  [LED_0603_1806Metric_IPC_N]
R82  680R  [R_0402_1005Metric_IPC_N]
U11  TLV75533PDBVR  [SOT-23-5]

### Ports
VIN (in, see Power_Supply[5C], LT3042_3V3[2B], LT3045_3V3[2B], XC6204_1V8[2B]), VOUT (out, see Power_Supply[6C])

### Nets
+3V3_STM32: C62.2 R82.1 U11.5(OUT) ; port VOUT
+4V_BUCK: C61.2 U11.1(IN) U11.3(CE) ; port VIN
GND: C61.1 C62.1 LED18.2 U11.2(GND)
NetLED18_1: LED18.1 R82.2

Not connected (* = marked no-connect by the designer): U11 4(NC)*

### Library data of the parts
C61 C62 = C000003: as C63 on sheet XC6204_1V8; ID: C000003; Capacitance: 1u; Tolerance: *; min Temperature: *; max Temperature: *; Case: 0603
LED18 = LED000007: as LED4 on sheet TPS61377_16V; ID: LED000007; Type: Low Current; Colour: Green; Forward Voltage: 2.2V; Current: 20mA; Case: 0603; ComponentLink1Description: Datasheet; ComponentLink1URL: https://www.mouser.de/datasheet/3/57/1/AV02_0551EN_DS_HSMx_Cxxx_25Mar2022.pdf; Supplier 1: Mouser; Supplier Part Number 1: 630-HSMG-C190; Supplier 2: Digikey; Supplier Part Number 2: 516-1425-1-ND
R82 = R000002: as R12 on sheet TPS61377_16V; ID: R000002; Resistance: 680R; Tolerance: *; Power Rating: *; Composition: *; min Temperature: *; max Temperature: *; Temp Coefficient: *; Case: 0402
U11 = PMIC000031: Manufacturer: Texas Instruments; ID: PMIC000031; Type: LDO; Manufacturer Part Number: TLV75533PDBVR; Part Value: TLV75533PDBVR; Case: SOT-23-5; ComponentLink1Description: Datasheet; ComponentLink1URL: https://www.ti.com/lit/ds/symlink/tlv755p.pdf?ts=1770973910931&ref_url=https%253A%252F%252Fwww.ti.com%252Fproduct%252FTLV755P%252Fpart-details%252FTLV75533PDRVR%253Futm_source%253Dgoogle%2526utm_medium%253Dcpc%2526utm_campaign%253Dapp-null-null-app_opn_en-cpc-storeic-google-eu_en_pur%2526utm_content%253DDevice%2526ds_k%253DTLV75533PDRVR%2526DCM%253Dyes%2526gclsrc%253Daw.ds%2526gad_source%253D1%2526gad_campaignid%253D18945642618%2526gbraid%253D0AAAAAC068F2EIKSMGn-IP6GsPs7bTaxyC%2526gclid%253DCjwKCAiAtLvMBhB_EiwA1u6_PkK8PpmP893KdmBSOr6UVtpkHgVfO7G8NLTFaKf8hjJC2576AnUZ2RoCVqoQAvD_BwE; Supplier 1: Digikey; Supplier Part Number 1: 296-50411-1-ND; Supplier 2: Mouser; Supplier Part Number 2: 595-TLV75533PDBVR

## Sheet MCU.SchDoc
size A2; SheetNumber: 12; SheetTotal: 25
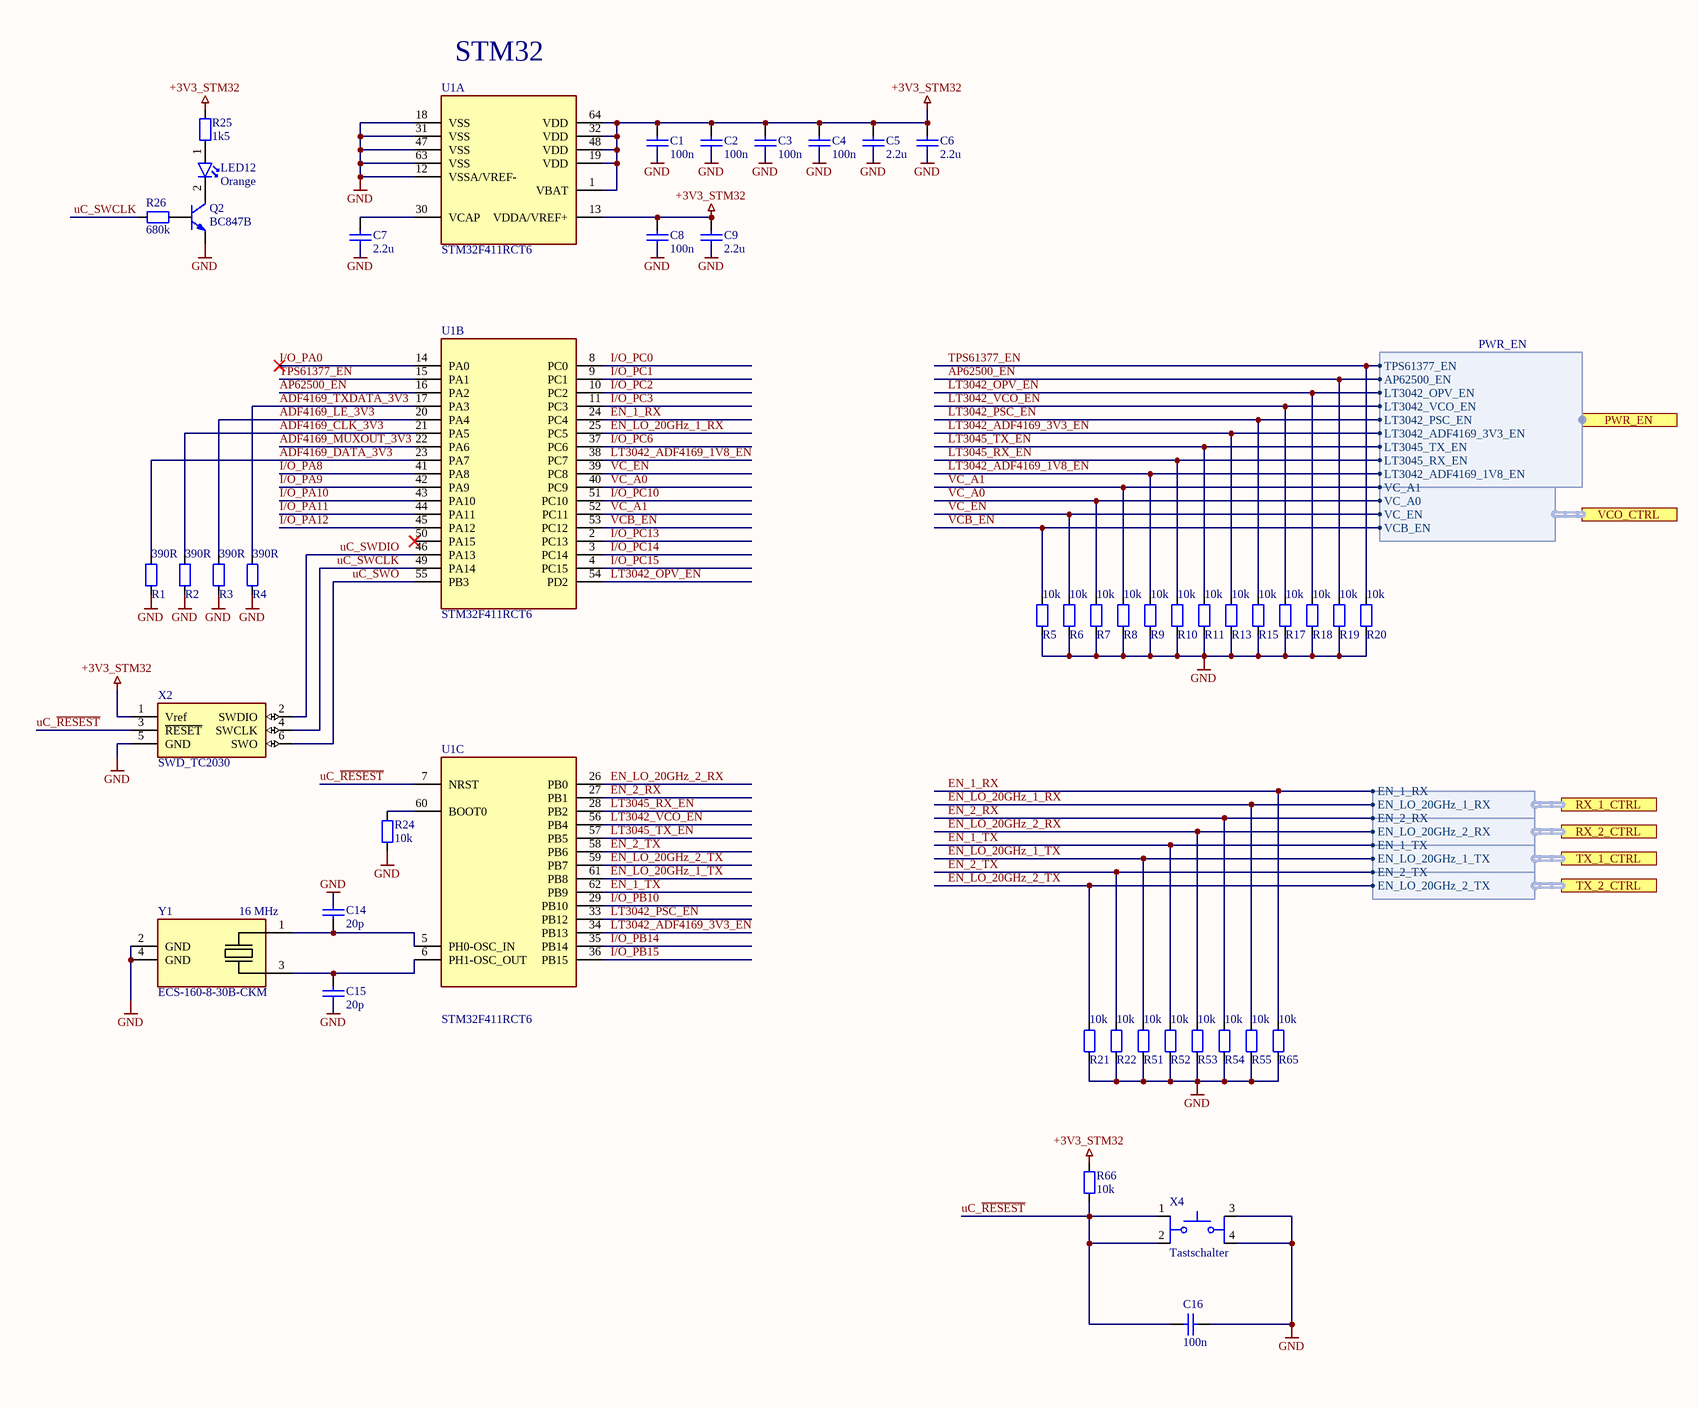
[diagram p11: MCU.SchDoc, left]
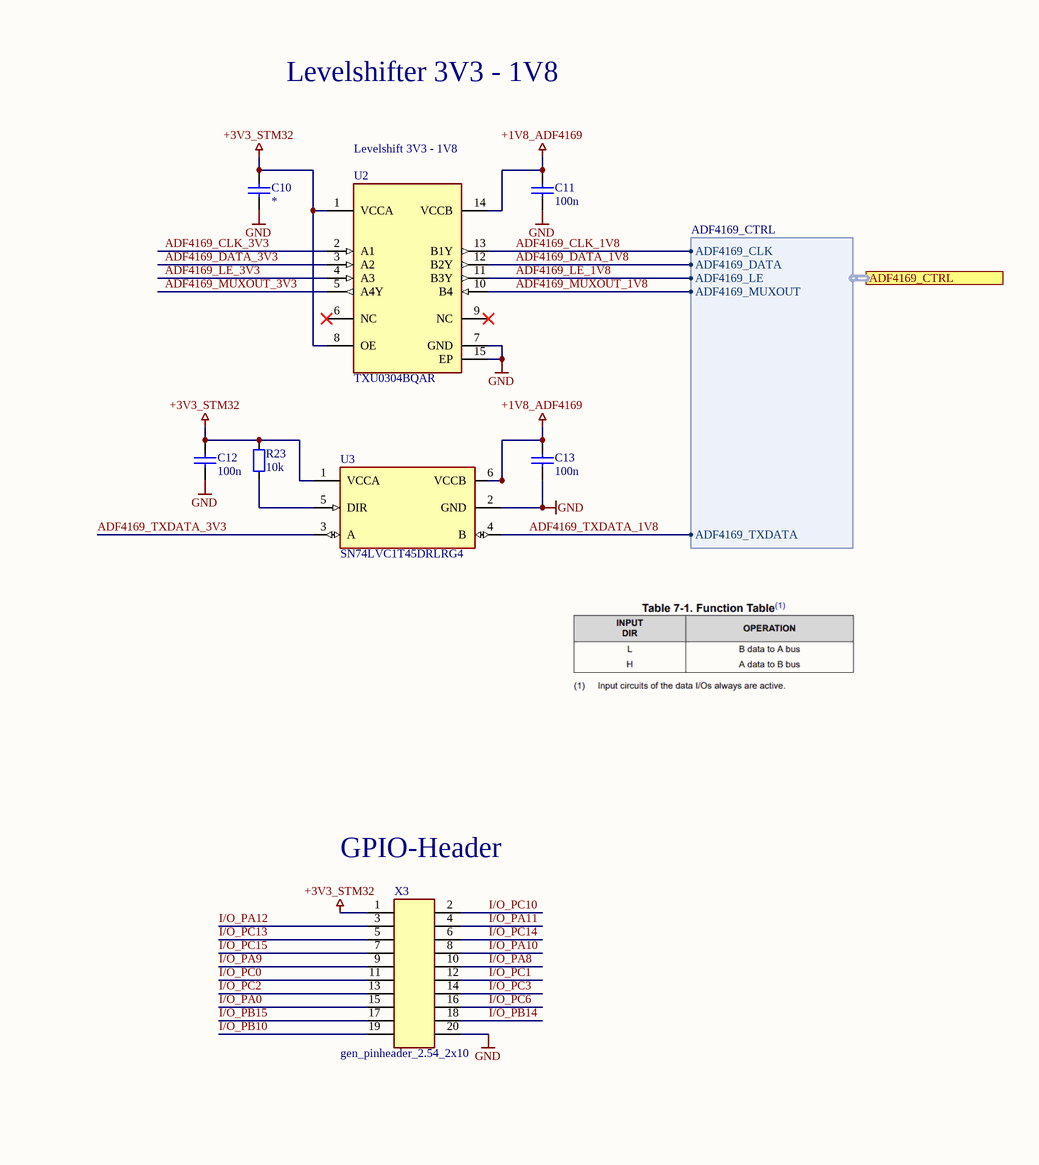
[diagram p12: MCU.SchDoc, right]

### Parts
C1  100n  [C_0402_1005Metric_IPC_N]
C2  100n  [C_0402_1005Metric_IPC_N]
C3  100n  [C_0402_1005Metric_IPC_N]
C4  100n  [C_0402_1005Metric_IPC_N]
C5  2.2u  [C_0603_1608Metric_IPC_N]
C6  2.2u  [C_0603_1608Metric_IPC_N]
C7  2.2u  [C_0603_1608Metric_IPC_N]
C8  100n  [C_0402_1005Metric_IPC_N]
C9  2.2u  [C_0603_1608Metric_IPC_N]
C10  *  [C_0402_1005Metric_IPC_N]
C11  100n  [C_0402_1005Metric_IPC_N]
C12  100n  [C_0402_1005Metric_IPC_N]
C13  100n  [C_0402_1005Metric_IPC_N]
C14  20p  [C_0402_1005Metric_IPC_N]
C15  20p  [C_0402_1005Metric_IPC_N]
C16  100n  [C_0402_1005Metric_IPC_N]
LED12  Orange  [LED_0603_1806Metric_IPC_N]
Q2  BC847B  [SOT-23-3]
R1  390R  [R_0402_1005Metric_IPC_N]
R2  390R  [R_0402_1005Metric_IPC_N]
R3  390R  [R_0402_1005Metric_IPC_N]
R4  390R  [R_0402_1005Metric_IPC_N]
R5  10k  [R_0402_1005Metric_IPC_N]
R6  10k  [R_0402_1005Metric_IPC_N]
R7  10k  [R_0402_1005Metric_IPC_N]
R8  10k  [R_0402_1005Metric_IPC_N]
R9  10k  [R_0402_1005Metric_IPC_N]
R10  10k  [R_0402_1005Metric_IPC_N]
R11  10k  [R_0402_1005Metric_IPC_N]
R13  10k  [R_0402_1005Metric_IPC_N]
R15  10k  [R_0402_1005Metric_IPC_N]
R17  10k  [R_0402_1005Metric_IPC_N]
R18  10k  [R_0402_1005Metric_IPC_N]
R19  10k  [R_0402_1005Metric_IPC_N]
R20  10k  [R_0402_1005Metric_IPC_N]
R21  10k  [R_0402_1005Metric_IPC_N]
R22  10k  [R_0402_1005Metric_IPC_N]
R23  10k  [R_0402_1005Metric_IPC_N]
R24  10k  [R_0402_1005Metric_IPC_N]
R25  1k5  [R_0402_1005Metric_IPC_N]
R26  680k  [R_0402_1005Metric_IPC_N]
R51  10k  [R_0402_1005Metric_IPC_N]
R52  10k  [R_0402_1005Metric_IPC_N]
R53  10k  [R_0402_1005Metric_IPC_N]
R54  10k  [R_0402_1005Metric_IPC_N]
R55  10k  [R_0402_1005Metric_IPC_N]
R65  10k  [R_0402_1005Metric_IPC_N]
R66  10k  [R_0402_1005Metric_IPC_N]
U1  STM32F411RCT6  [QFP50P1200X1200X160-64N]  (parts A,B,C of 3)
U2  TXU0304BQAR  [WQFN-14-1EP_2.5x3mm_P0.5mm_EP1.0x1.5mm_IPC_N]
U3  SN74LVC1T45DRLRG4  [SOTFL50P160X60-6N]
X2  SWD_TC2030  [Tag-Connect_TC2030-IDC-FP_2x03_P1.27mm_Vertical]  (no BOM)
X3  gen_pinheader_2.54_2x10  [Pinheader_2.54_2x10]
X4  Tastschalter  [TL3301AF160QG]
Y1  ECS-160-8-30B-CKM  [XTAL_SMD_5032_4Pin_5x3.2mm]

### Ports
ADF4169_CTRL (harness ADF4169_CTRL, see Top_Level[2B], PLL_ADF4169[1C]), PWR_EN (harness PWR_EN, see Top_Level[2B], Power_Supply[1A]), RX_1_CTRL (harness RX_1_CTRL, see Top_Level[2B], RX_RUBVERANO[2C]), RX_2_CTRL (harness RX_2_CTRL, see Top_Level[2B], RX_RUBVERANO[7C]), TX_1_CTRL (harness TX_1_CTRL, see Top_Level[2B], TX_RUBVERANO[7D]), TX_2_CTRL (harness TX_2_CTRL, see Top_Level[2B], TX_RUBVERANO[2D]), VCO_CTRL (harness VCO_CTRL, see Top_Level[2B], VCO_HMC8364[1B])

### Harnesses
ADF4169_CTRL: ADF4169_MUXOUT, ADF4169_CLK, ADF4169_DATA, ADF4169_LE, ADF4169_TXDATA
PWR_EN: AP62500_EN, LT3042_OPV_EN, LT3042_VCO_EN, LT3042_PSC_EN, LT3042_ADF4169_3V3_EN, LT3045_TX_EN, TPS61377_EN, LT3042_ADF4169_1V8_EN, LT3045_RX_EN
VCO_CTRL: VCB_EN, VC_EN, VC_A0, VC_A1
RX_1_CTRL: EN_1_RX, EN_LO_20GHz_1_RX
RX_2_CTRL: EN_2_RX, EN_LO_20GHz_2_RX
TX_1_CTRL: EN_LO_20GHz_1_TX, EN_1_TX
TX_2_CTRL: EN_LO_20GHz_2_TX, EN_2_TX

### Nets
+1V8_ADF4169: C11.2 C13.2 U2.14(VCCB) U3.6(VCCB)
+3V3_STM32: C1.2 C2.2 C3.2 C4.2 C5.2 C6.2 C8.2 C9.2 C10.2 C12.2 R23.1 R25.2 R66.2 U1.1(VBAT) U1.13(VDDA/VREF+) U1.19(VDD) U1.32(VDD) U1.48(VDD) U1.64(VDD) U2.1(VCCA) U2.8(OE) U3.1(VCCA) X2.1(Vref) X3.1
GND: C1.1 C2.1 C3.1 C4.1 C5.1 C6.1 C7.1 C8.1 C9.1 C10.1 C11.1 C12.1 C13.1 C14.2 C15.1 C16.2 Q2.2(E) R1.1 R2.1 R3.1 R4.1 R5.1 R6.1 R7.1 R8.1 R9.1 R10.1 R11.1 R13.1 R15.1 R17.1 R18.1 R19.1 R20.1 R21.1 R22.1 R24.2 R51.1 R52.1 R53.1 R54.1 R55.1 R65.1 U1.12(VSSA/VREF-) U1.18(VSS) U1.31(VSS) U1.47(VSS) U1.63(VSS) U2.7(GND) U2.15(EP) U3.2(GND) X2.5(GND) X3.20 X4.3 X4.4 Y1.2(GND) Y1.4(GND)
ADF4169_CLK_1V8: U2.13(B1Y) ; port ADF4169_CTRL.ADF4169_CLK
ADF4169_CLK_3V3: R2.2 U1.21(PA5) U2.2(A1)
ADF4169_DATA_1V8: U2.12(B2Y) ; port ADF4169_CTRL.ADF4169_DATA  [project net ADF4169_CTRL.ADF4169_DATA]
ADF4169_DATA_3V3: R1.2 U1.23(PA7) U2.3(A2)
ADF4169_LE_1V8: U2.11(B3Y) ; port ADF4169_CTRL.ADF4169_LE  [project net ADF4169_CTRL.ADF4169_LE]
ADF4169_LE_3V3: R3.2 U1.20(PA4) U2.4(A3)
ADF4169_MUXOUT_1V8: U2.10(B4) ; port ADF4169_CTRL.ADF4169_MUXOUT  [project net ADF4169_CTRL.ADF4169_MUXOUT]
ADF4169_MUXOUT_3V3: U1.22(PA6) U2.5(A4Y)
ADF4169_TXDATA_1V8: U3.4(B) ; port ADF4169_CTRL.ADF4169_TXDATA  [project net ADF4169_CTRL.ADF4169_TXDATA]
ADF4169_TXDATA_3V3: R4.2 U1.17(PA3) U3.3(A)
AP62500_EN: R19.2 U1.16(PA2) ; port PWR_EN.AP62500_EN
EN_1_RX: R65.2 U1.24(PC4) ; port RX_1_CTRL.EN_1_RX
EN_1_TX: R52.2 U1.62(PB9) ; port TX_1_CTRL.EN_1_TX
EN_2_RX: R54.2 U1.27(PB1) ; port RX_2_CTRL.EN_2_RX
EN_2_TX: R22.2 U1.58(PB6) ; port TX_2_CTRL.EN_2_TX
EN_LO_20GHz_1_RX: R55.2 U1.25(PC5) ; port RX_1_CTRL.EN_LO_20GHz_1_RX
EN_LO_20GHz_1_TX: R51.2 U1.61(PB8) ; port TX_1_CTRL.EN_LO_20GHz_1_TX
EN_LO_20GHz_2_RX: R53.2 U1.26(PB0) ; port RX_2_CTRL.EN_LO_20GHz_2_RX
EN_LO_20GHz_2_TX: R21.2 U1.59(PB7) ; port TX_2_CTRL.EN_LO_20GHz_2_TX
I/O_PA0: U1.14(PA0) X3.15
I/O_PA8: U1.41(PA8) X3.10
I/O_PA9: U1.42(PA9) X3.9
I/O_PA10: U1.43(PA10) X3.8
I/O_PA11: U1.44(PA11) X3.4
I/O_PA12: U1.45(PA12) X3.3
I/O_PB10: U1.29(PB10) X3.19
I/O_PB14: U1.35(PB14) X3.18
I/O_PB15: U1.36(PB15) X3.17
I/O_PC0: U1.8(PC0) X3.11
I/O_PC1: U1.9(PC1) X3.12
I/O_PC2: U1.10(PC2) X3.13
I/O_PC3: U1.11(PC3) X3.14
I/O_PC6: U1.37(PC6) X3.16
I/O_PC10: U1.51(PC10) X3.2
I/O_PC13: U1.2(PC13) X3.5
I/O_PC14: U1.3(PC14) X3.6
I/O_PC15: U1.4(PC15) X3.7
LT3042_ADF4169_1V8_EN: R9.2 U1.38(PC7) ; port PWR_EN.LT3042_ADF4169_1V8_EN
LT3042_ADF4169_3V3_EN: R13.2 U1.34(PB13) ; port PWR_EN.LT3042_ADF4169_3V3_EN
LT3042_OPV_EN: R18.2 U1.54(PD2) ; port PWR_EN.LT3042_OPV_EN
LT3042_PSC_EN: R15.2 U1.33(PB12) ; port PWR_EN.LT3042_PSC_EN
LT3042_VCO_EN: R17.2 U1.56(PB4) ; port PWR_EN.LT3042_VCO_EN
LT3045_RX_EN: R10.2 U1.28(PB2) ; port PWR_EN.LT3045_RX_EN
LT3045_TX_EN: R11.2 U1.57(PB5) ; port PWR_EN.LT3045_TX_EN
TPS61377_EN: R20.2 U1.15(PA1) ; port PWR_EN.TPS61377_EN
uC_~{RESEST}: C16.1 R66.1 U1.7(NRST) X2.3(~{RESET}) X4.1 X4.2
uC_SWCLK: R26.1 U1.49(PA14) X2.4(SWCLK)
uC_SWDIO: U1.46(PA13) X2.2(SWDIO)
uC_SWO: U1.55(PB3) X2.6(SWO)
VC_A0: R7.2 U1.40(PC9) ; port VCO_CTRL.VC_A0
VC_A1: R8.2 U1.52(PC11) ; port VCO_CTRL.VC_A1
VC_EN: R6.2 U1.39(PC8) ; port VCO_CTRL.VC_EN
VCB_EN: R5.2 U1.53(PC12) ; port VCO_CTRL.VCB_EN
NetC7_2: C7.2 U1.30(VCAP)
NetC14_1: C14.1 U1.5(PH0-OSC_IN) Y1.1(IN/OUT)
NetC15_2: C15.2 U1.6(PH1-OSC_OUT) Y1.3(IN/OUT)
NetLED12_1: LED12.1 R25.1
NetLED12_2: LED12.2 Q2.3(C)
NetQ2_1: Q2.1(B) R26.2
NetR23_2: R23.2 U3.5(DIR)
NetR24_1: R24.1 U1.60(BOOT0)

Not connected (* = marked no-connect by the designer): U1 50(PA15)*; U2 6(NC)* 9(NC)*

### Notes on the sheet
- STM32
- Levelshifter 3V3 - 1V8
- Levelshift 3V3 - 1V8
- (near X3) GPIO-Header
- (near Y1) 16 MHz

### Library data of the parts
C1-C4 C8 C11-C13 = C000002: Generic MLCC with 0402 Footprint; Specific Component: False; Tolerance: 10%; Temp Coefficient: X7R; Voltage Rated: 50V; ID: C000002; Capacitance: 100n; min Temperature: *; max Temperature: *; Case: 0402; Supplier 1: Mouser; Supplier Part Number 1: 81-GRM155R71H104KE4D; Supplier 2: Digikey; Supplier Part Number 2: 490-10700-1-ND
C5-C7 C9 = C000003: as C28 on sheet AP62500_4V; ID: C000003; Capacitance: 2.2u; Tolerance: *; Temp Coefficient: *; Voltage Rated: *; min Temperature: *; max Temperature: *; Case: 0603; Supplier 1: Mouser; Supplier Part Number 1: 81-GRM188R61E225KA2D
C10 C14-C16 = C000002: as C23 on sheet TPS61377_16V; ID: C000002; Tolerance: *; Temp Coefficient: *; Voltage Rated: *; min Temperature: *; max Temperature: *; Case: 0402
  C10: Capacitance: *
  C14 C15: Capacitance: 20p; Supplier 1: Arrow Electronics; Supplier Part Number 1: C0402C200F5GACTU
  C16: Capacitance: 100n
LED12 = LED000008: MLCC, Low Current, Orange, 2.2V, 20mA, 0603; Manufacturer: Broadcom / Avago; Manufacturer Part Number: HSMD-C190; Specific Component: True; ID: LED000008; Type: Low Current; Colour: Orange; Forward Voltage: 2.2V; Current: 20mA; Case: 0603; ComponentLink1Description: Datasheet; ComponentLink1URL: https://www.mouser.de/datasheet/3/57/1/AV02_0551EN_DS_HSMx_Cxxx_25Mar2022.pdf; Supplier 1: Mouser; Supplier Part Number 1: 630-HSMD-C190; Supplier 2: Digikey; Supplier Part Number 2: 516-2489-1-ND
Q2 = PMIC000033: Manufacturer: Diotec Semiconductor; ID: PMIC000033; Type: NPN; Manufacturer Part Number: BC847B; Part Value: BC847B; Case: SOT-23-3; ComponentLink1Description: Datasheet; ComponentLink1URL: https://diotec.com/request/datasheet/bc846.pdf; Supplier 1: Digikey; Supplier Part Number 1: 4878-BC847BCT-ND; Supplier 2: Mouser; Supplier Part Number 2: 637-BC847B
R1-R11 R13 R15 R17-R26 R51-R55 R65 R66 = R000002: as R12 on sheet TPS61377_16V; ID: R000002; Tolerance: *; Power Rating: *; Composition: *; min Temperature: *; max Temperature: *; Temp Coefficient: *; Case: 0402
  R1-R4: Resistance: 390R
  R5-R11 R13 R15 R17-R24 R51-R55 R65 R66: Resistance: 10k
  R25: Resistance: 1k5
  R26: Resistance: 680k
U1 = MC000003: Arm Cortex-M4 32b MCU+FPU, 125 DMIPS, 512KB Flash, 128KB RAM, USB OTG FS, 11 TIMs, 1 ADC, 13 comm. interfaces; Manufacturer_Name: STMicroelectronics; Geometry.Height: 1.6mm; Mouser Part Number: 511-STM32F411RCT6; Mouser Price/Stock: https://www.mouser.co.uk/ProductDetail/STMicroelectronics/STM32F411RCT6?qs=pjMTYa9MTGUZXWYoQTNtbQ%3D%3D; Manufacturer_Part_Number: STM32F411RCT6; Datasheet Link: https://www.st.com/resource/en/datasheet/stm32f411ce.pdf; ID: MC000003; Manufacturer: STMicroelectronics; Manufacturer Part Number: STM32F411RCT6; Part Value: STM32F411RCT6; Case: LQFP-64; ComponentLink1Description: Datasheet; ComponentLink1URL: https://www.st.com/resource/en/datasheet/stm32f411ce.pdf; Supplier 1: Mouser; Supplier Part Number 1: 511-STM32F411RCT6; Supplier 2: Digikey; Supplier Part Number 2: 497-14908-ND
U2 = LG000017: Manufacturer: Texas Instruments; ID: LG000017; Type: Level Shifter; Manufacturer Part Number: TXU0304BQAR; Part Value: TXU0304BQAR; Case: 14-WQFN (2.5x3); ComponentLink1Description: Datasheet; ComponentLink1URL: https://www.ti.com/de/lit/gpn/txu0304; Supplier 1: Digikey; Supplier Part Number 1: 296-TXU0304BQARCT-ND; Supplier 2: Mouser; Supplier Part Number 2: 595-TXU0304BQAR
U3 = LG000019: Manufacturer: Texas Instruments; ID: LG000019; Type: Level Shifter; Manufacturer Part Number: SN74LVC1T45DRLRG4; Part Value: SN74LVC1T45DRLRG4; Case: SOT-6; ComponentLink1Description: Datasheet; ComponentLink1URL: https://www.ti.com/lit/ds/symlink/sn74lvc1t45.pdf?ts=1771738482652; Supplier 1: Digikey; Supplier Part Number 1: 296-52736-1-ND; Supplier 2: Mouser; Supplier Part Number 2: 595-74LVC1T45DRLRG4
X2 = X000003: Manufacturer Part Number: SWD TC2030; Manufacturer: Tag-Connect; ID: X000003; Type: SWD TC2030; Part Value: SWD TC2030; Case: TC2030; ComponentLink1Description: Datasheet; ComponentLink1URL: https://www.tag-connect.com/wp-content/uploads/bsk-pdf-manager/TC2030-CTX_1.pdf
X3 = X000025: Manufacturer Part Number: TSW-110-07-G-D; Manufacturer: Samtec; ID: X000025; Type: gen_pinheader_2.54_2x10; Part Value: gen_pinheader_2.54_2x10; ComponentLink1Description: Datasheet; ComponentLink1URL: https://www.mouser.de/datasheet/3/85/1/htsw_th.pdf; Supplier 1: Digikey; Supplier Part Number 1: SAM1028-10-ND; Supplier 2: Mouser; Supplier Part Number 2: 200-TSW11007GD
X4 = X000024: Manufacturer: E-Switch; ID: X000024; Type: Tastschalter; Manufacturer Part Number: TL3301AF160QG; Part Value: TL3301AF160QG; Case: TL3301; ComponentLink1Description: Datasheet; ComponentLink1URL: https://configured-product-images.s3.amazonaws.com/Datasheets/TL3301.pdf; Supplier 1: Digikey; Supplier Part Number 1: EG2526CT-ND
Y1 = Y000001: Manufacturer: ECS; ID: Y000001; Type: XTAL; Manufacturer Part Number: ECS-160-8-30B-CKM; Part Value: ECS-160-8-30B-CKM; Case: SMD 4-Pin 5x3.2mm; ComponentLink1Description: Datasheet; ComponentLink1URL: https://ecsxtal.com/store/pdf/ecx_53b.pdf; Supplier 1: Digikey; Supplier Part Number 1: XC1839CT-ND; Supplier 2: Mouser; Supplier Part Number 2: 520-160-8-30B-CKM